# Altium project LF-timegate-REVB.PrjPcb (part 1 of 2)
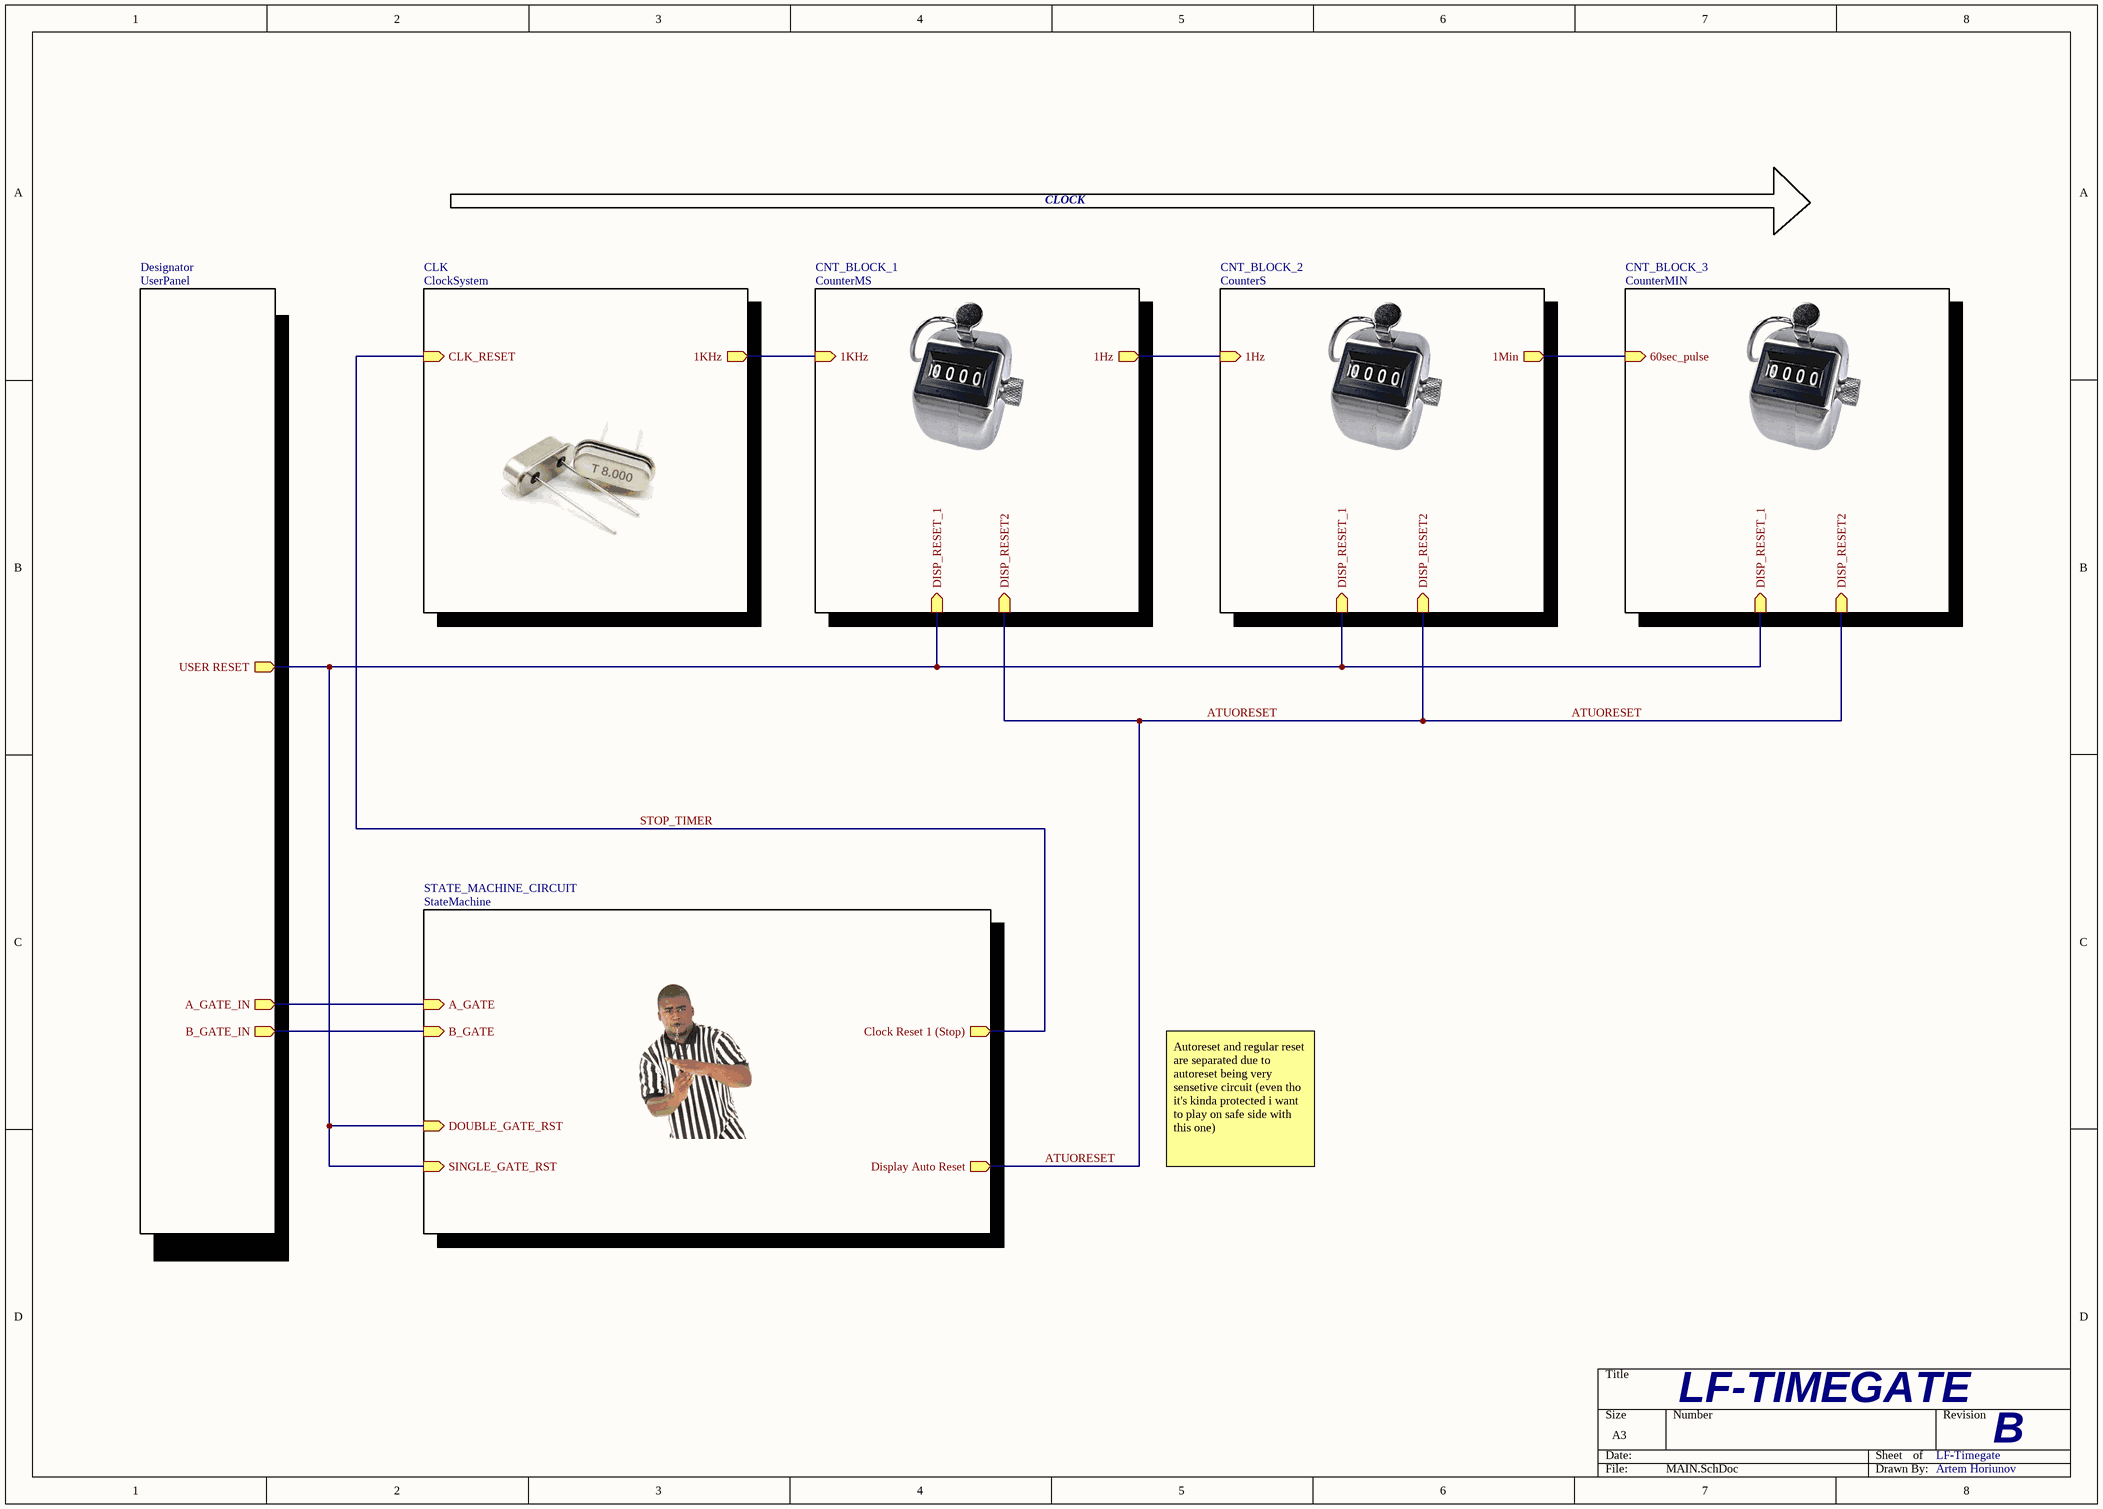
[diagram p0: MAIN.SchDoc]
12 sheets, 214 parts. Net scope: hierarchical (ports join the sheet entries above them; power ports are global).
Sheets:
  MAIN.SchDoc
    CLK = ClockSystem.SchDoc
    CNT_BLOCK_1 = CounterMS.SchDoc
      CNT1 = Counter_Normal.SchDoc
      CNT2 = Counter_Normal.SchDoc
      CNT3 = Counter_INV.SchDoc
        DISP? = LSD150BAG-101-01.SchDoc
    CNT_BLOCK_2 = CounterS.SchDoc
      CNT4 = Counter_Normal.SchDoc
      CNT5 = Counter_INV.SchDoc
        DISP? = LSD150BAG-101-01.SchDoc
    CNT_BLOCK_3 = CounterMIN.SchDoc
      CNT1 = Counter_Normal.SchDoc
    STATE_MACHINE_CIRCUIT = StateMachine.SchDoc
      SR LATCH CIRCUIT = SR.SchDoc
      EDGE DETECTOR = Autoreset.SchDoc
    Designator = UserPanel.SchDoc

## Sheet MAIN.SchDoc
size A3; SheetNumber: 1; SheetTotal: 12

### Sub-sheets
CLK = ClockSystem: CLK_RESET (in), 1KHz (out)
CNT_BLOCK_1 = CounterMS: DISP_RESET2 (in), DISP_RESET_1 (in), 1Hz (out), 1KHz (in)
CNT_BLOCK_2 = CounterS: DISP_RESET2 (in), DISP_RESET_1 (in), 1Hz (in), 1Min (out)
CNT_BLOCK_3 = CounterMIN: DISP_RESET2 (in), DISP_RESET_1 (in), 60sec_pulse (in)
Designator = UserPanel: A_GATE_IN (out), B_GATE_IN (out), USER RESET (out)
STATE_MACHINE_CIRCUIT = StateMachine: B_GATE (in), DOUBLE_GATE_RST (in), A_GATE (in), SINGLE_GATE_RST (in), Clock Reset 1 (Stop) (out), Display Auto Reset (out)

### Nets
1Hz: sheet CNT_BLOCK_1/1Hz, sheet CNT_BLOCK_2/1Hz
1KHz: sheet CLK/1KHz, sheet CNT_BLOCK_1/1KHz
1Min: sheet CNT_BLOCK_2/1Min, sheet CNT_BLOCK_3/60sec_pulse
ATUORESET: sheet CNT_BLOCK_1/DISP_RESET2, sheet CNT_BLOCK_2/DISP_RESET2, sheet CNT_BLOCK_3/DISP_RESET2, sheet STATE_MACHINE_CIRCUIT/Display Auto Reset
CNT_RESET1: sheet CNT_BLOCK_1/DISP_RESET_1, sheet CNT_BLOCK_2/DISP_RESET_1, sheet CNT_BLOCK_3/DISP_RESET_1, sheet STATE_MACHINE_CIRCUIT/DOUBLE_GATE_RST, sheet STATE_MACHINE_CIRCUIT/SINGLE_GATE_RST, sheet Designator/USER RESET
STOP_TIMER: sheet CLK/CLK_RESET, sheet STATE_MACHINE_CIRCUIT/Clock Reset 1 (Stop)
NetA_GATE_1: sheet STATE_MACHINE_CIRCUIT/A_GATE, sheet Designator/A_GATE_IN
NetB_GATE_1: sheet STATE_MACHINE_CIRCUIT/B_GATE, sheet Designator/B_GATE_IN

### Notes on the sheet
- CLOCK
- Autoreset and regular reset are separated due to autoreset being very sensetive circuit (even tho it's kinda protected i want to play on safe side with this one)
- LF-TIMEGATE
- LF-Timegate
- B
- Artem Horiunov

## Sheet ClockSystem.SchDoc
size A4; SheetNumber: 2; SheetTotal: 12
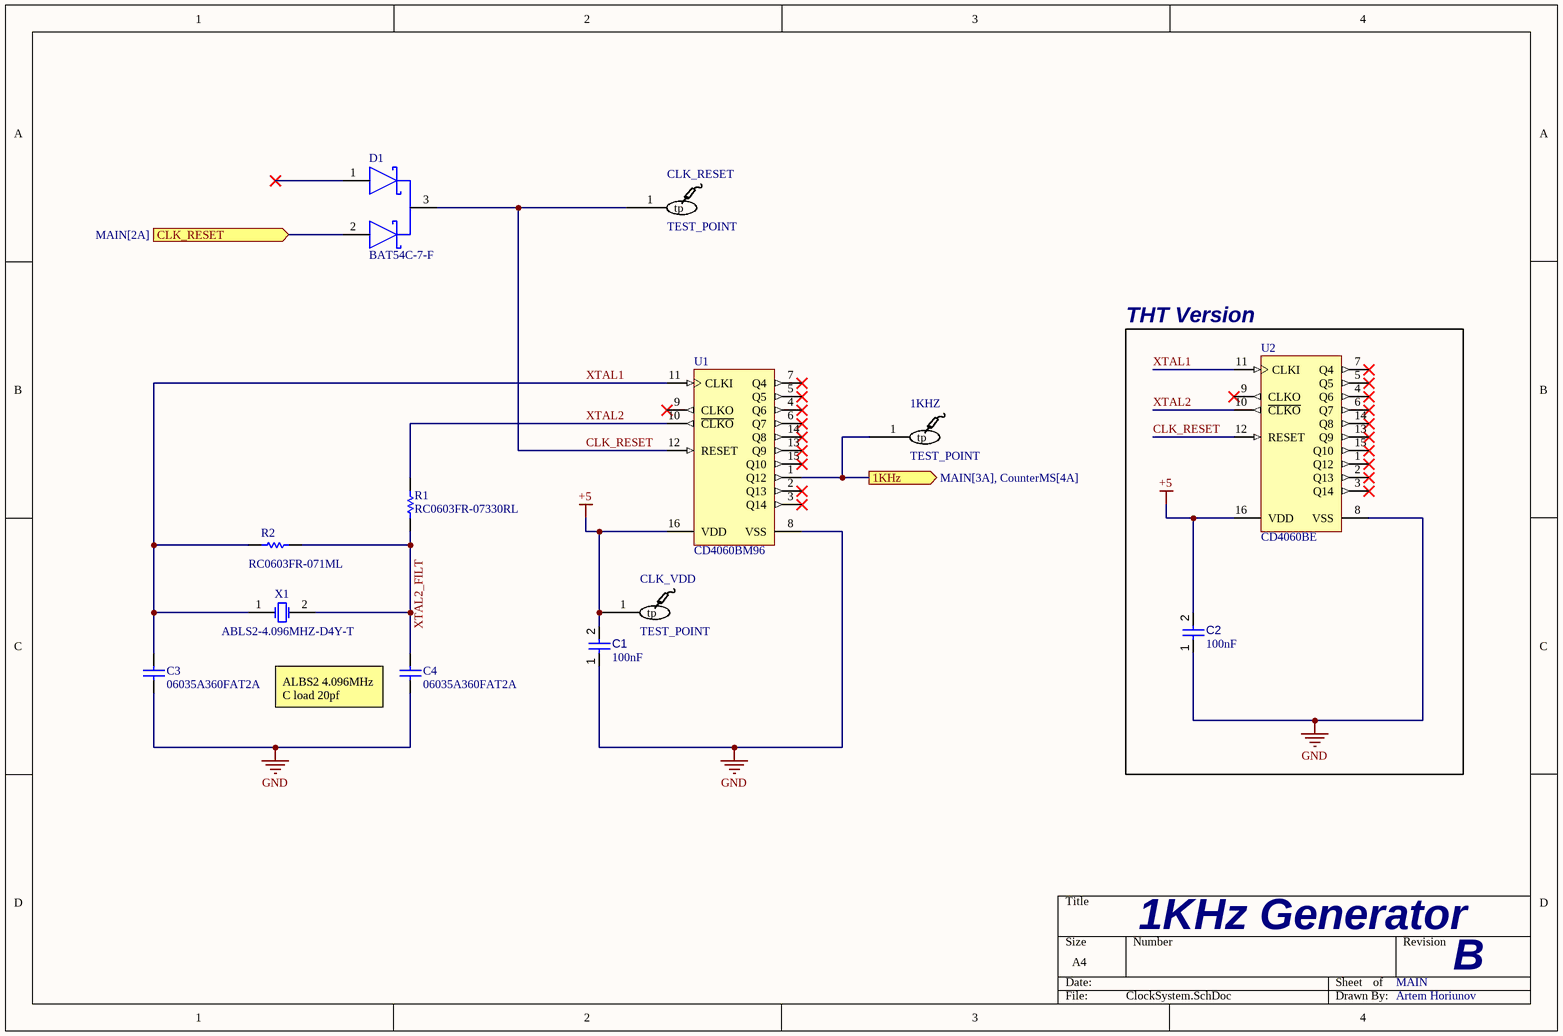
[diagram p1: ClockSystem.SchDoc]

### Parts
1KHZ  TEST_POINT  [TestPoint-Footprint-1]
C1  value 100nF  [CAPC2013X95X50LL10T25]  (hidden comment: Capacitor 100 nF +/-10% 50 V 0805)
C2  value 100nF  [CAPC2013X95X50LL10T25]  (hidden comment: Capacitor 100 nF +/-10% 50 V 0805)
C3  06035A360FAT2A  [CAPC1608X90X35LL15T15]
C4  06035A360FAT2A  [CAPC1608X90X35LL15T15]
CLK_RESET  TEST_POINT  [TestPoint-Footprint-1]
CLK_VDD  TEST_POINT  [TestPoint-Footprint-1]
D1  BAT54C-7-F  [FP-SOT23-IPC_B]
R1  RC0603FR-07330RL  [RESC1608X55X25NL10T15]
R2  RC0603FR-071ML  [RESC1608X55X25LL10T15]
U1  CD4060BM96  [D0016A_L]
U2  CD4060BE  [N0016A]
X1  ABLS2-4.096MHZ-D4Y-T  [ABRA-ABLS2-2_V]

### Blocks framed on the sheet
THT Version: C2 U2

### Ports
1KHz (out, see MAIN[3A], CounterMS[4A]), CLK_RESET (in, see MAIN[2A])

### Nets
+5: C1.2 C2.2 CLK_VDD.1(tp) U1.16(VDD) U2.16(VDD)
GND: C1.1 C2.1 C3.1 C4.1 U1.8(VSS) U2.8(VSS)  [project net R-SEG]
1KHz: 1KHZ.1(tp) U1.1(Q12) ; port 1KHz
CLK_RESET: CLK_RESET.1(tp) D1.3(COMMON_CATHODE) U1.12(RESET) U2.12(RESET)
STOP_TIMER: D1.2(2_ANODE) ; port CLK_RESET
XTAL1: C3.2 R2.1 U1.11(CLKI) U2.11(CLKI) X1.1(X1)
XTAL2: R1.2 U1.10(~{CLKO}) U2.10(~{CLKO})
XTAL2_FILT: C4.2 R1.1 R2.2 X1.2(X2)

Not connected (* = marked no-connect by the designer): D1 1(1_ANODE)*; U1 2(Q13)* 3(Q14)* 4(Q6)* 5(Q5)* 6(Q7)* 7(Q4)* 9(CLKO)* 13(Q9)* 14(Q8)* 15(Q10)*; U2 1(Q12)* 2(Q13)* 3(Q14)* 4(Q6)* 5(Q5)* 6(Q7)* 7(Q4)* 9(CLKO)* 13(Q9)* 14(Q8)* 15(Q10)*

### Notes on the sheet
- (near C4) ALBS2 4.096MHz C load 20pf
- 1KHz Generator
- MAIN
- B
- Artem Horiunov

### Library data of the parts
1KHZ CLK_RESET CLK_VDD = CMP-00001-5: Pad for testing
C1 C2 = CMP-001-00018-6: Chip Capacitor, 100 nF, +/- 10%, 50 V, 0805 (2012 Metric); Capacitor Type: Ceramic; Voltage Rating: 50V; Pins: 2; Max Operating Temperature: 125°C; Min Operating Temperature: -55°C; Mounting Technology: SM; Case/Package: 0805; RoHS Compliant: True; Tolerance: 10%
C3 C4 = CMP-2006-04595-1: Manufacturer: AVX Interconnect / Elco; Part Number: 06035A360FAT2A
D1 = CMP-12790-000084-1: DIODE ARRAY SCHOTTKY 30V SOT23-3; Max Reverse Current: 2uA; Power Dissipation: 200mW; Average Rectified Current: 200mA; Capacitance: 10pF; Peak Non-Repetitive Surge Current: 600mA; Forward Voltage: 800mV; Reverse Recovery Time: 5ns; Element Configuration: Common Cathode; Max Operating Temperature: 150°C; Max Reverse Voltage (DC): 30V; Power Rating: 200mW; Termination: SMD/SMT; REACH SVHC: No SVHC; Voltage Rating (DC): 30V; Series: -; Current Rating: 200mA; RoHS Compliant: Yes; Max Power Dissipation: 200mW; Case/Package: SOT-23; Max Repetitive Reverse Voltage (Vrrm): 30V; Width: 1.3mm; Min Operating Temperature: -65°C; Lead Free: Lead Free; Forward Current: 200mA; Number of Pins: 3; Contact Plating: Tin; Package Quantity: 3000; Length: 2.9mm; Radiation Hardening: No; Max Forward Surge Current (Ifsm): 600mA; Height: 1mm; Packaging: Tape and Reel; Mount: Surface Mount; Weight: 0.000282oz
R1 = CMP-1659-00020-2: Chip Resistor, 330 Ohm, +/- 1%, 0.1 W, -55 to 155 degC, 0603 (1608 Metric), RoHS, Tape and Reel; Tolerance: 10%; ESR: 800 mohm; Voltage Rating (DC): 16 V; Capacitance: 47 uF; Length: 7.3 mm; ComponentLink1URL: http://www.yageo.com/; Packaging: Tape and Reel; Pins: 2; ComponentLink1Description: Manufacturer URL; Case Code (Imperial): 2917; REACH SVHC: No SVHC; Width: 4.3 mm; ComponentLink2Description: Datasheet; Voltage Rating: 16 V; RoHSCompliant: True; Max Operating Temperature: 125degC; ComponentLink2URL: http://www.yageo.com/documents/recent/PYu-RC_Group_51_RoHS_L_04.pdf; Min Operating Temperature: -55degC; Case/Package: 2917; Radiation Hardening: No; DatasheetVersion: Rev. 4, 02/2016; Mount: Surface Mount; PackageReference: 0603; Package Quantity: 500; Case Code (Metric): 7343; PackageDescription: 2-Pin Surface Mount Device, Body 1.6 x 0.8 mm; Height: 3.1 mm
R2 = CMP-1659-00056-1: Chip Resistor, 1 MOhm, +/- 1%, 100 mW, -55 to 155 degC, 0603 (1608 Metric), RoHS, Tape and Reel; Voltage Rating (DC): 25 V; Tolerance: 20%; Case\Package: Radial; Capacitance: 1 mF; Min Operating Temperature: -40 degC; PackageDescription: 2-Pin Surface Mount Device, Body 1.6 x 0.8 mm; ComponentLink1Description: Manufacturer URL; Radiation Hardening: No; DatasheetVersion: Rev. 4, 02/2016; REACH SVHC: No SVHC; Length: 20 mm; Max Operating Temperature: 85 degC; Diameter: 10 mm; Packaging: Bulk; Package Quantity: 200; PackageReference: 0603; Mount: Through Hole; ComponentLink1URL: http://www.yageo.com/; ComponentLink2URL: http://www.yageo.com/documents/recent/PYu-RC_Group_51_RoHS_L_04.pdf; ComponentLink2Description: Datasheet; Width: 0 inch; Lead Pitch: 5 mm; RoHSCompliant: true; Voltage Rating: 25 V; Height: 20 mm
U1 = CMP-1086-00004-4: CMOS 14-Stage Ripple Carry Binary Counter / Divider and Oscillator, 3 to 18 V, -55 to 125 degC, 16-Pin SOIC (D), Green (RoHS & no Sb/Br), Tape and Reel; Manufacturer: Texas Instruments; tPHL, tPLH (typ) @ 5 V: 370 ns; VDD: 3 to 18 V; Mounting Technology: Surface Mount; PackageReference: D0016A; ComponentLink3URL: http://www.ti.com/lit/ml/mpds178g/mpds178g.pdf; ComponentLink3Description: Package Specification; ComponentLink2URL: http://www.ti.com/lit/ds/symlink/cd4060b.pdf; PackageVersion: 4040047-6/M; PackageDescription: 16-Pin Plastic Small-Outline Package, Body 9.9 x 3.9 mm, Pitch 1.27 mm; DatasheetVersion: SCHS049C; PartNumber: CD4060BM96; ComponentLink2Description: Datasheet; Note1: Green (RoHS & no Sb/Br); ComponentLink1Description: Manufacturer URL; Temperature Range: -55 to 125 degC; Packing: Tape and Reel; ComponentLink1URL: http://www.ti.com
U2 = CMP-1086-00011-4: CMOS 14-Stage Ripple Carry Binary Counter / Divider and Oscillator, 3 to 18 V, -55 to 125 degC, 16-Pin PDIP (N), RoHS, Tube; Manufacturer: Texas Instruments; tPHL, tPLH (typ) @ 5 V: 370 ns; VDD: 3 to 18 V; PackageDescription: 16-Pin Plastic Dual In-Line Package, Body 19.305 x 6.35 mm, Pitch 2.54 mm; ComponentLink1URL: http://www.ti.com; ComponentLink3Description: Package Specification; DatasheetVersion: SCHS049C; PackageVersion: 4040049/E; Packing: Tube; ComponentLink2Description: Datasheet; Mounting Technology: Through Hole; ComponentLink2URL: http://www.ti.com/lit/ds/symlink/cd4060b.pdf; ComponentLink3URL: http://www.ti.com/lit/ml/mpdi002c/mpdi002c.pdf; Temperature Range: -55 to 125 degC; PackageReference: N0016A; ComponentLink1Description: Manufacturer URL; RoHS: TRUE; PartNumber: CD4060BE
X1 = CMP-0277-00002-1: Low Profile Surface Mount Microprocessor Crystal, 4.096 MHz +/-30 ppm, 180 Ohm, -40 to 85 degC, 2-Pin 11.4 x 4.7 x 3.3 mm SMD, RoHS, Tape and Reel; Manufacturer: Abracon; Operation Mode: Fundamental or 3rd Overtone; Shunt Capacitance: 7 pF Max.; ESR: 180 Ohm; Load Capacitance: 18 pF; Mounting Technology: Surface Mount; PackageDescription: 2-Pin SMD, Body 11.4 x 4.7 mm, Height 3.3 mm; ComponentLink1URL: http://www.abracon.com/; Freq. Stability: +/- 30 ppm; ComponentLink2Description: Datasheet; PartNumber: ABLS2-4.096MHZ-D4Y-T; Operating Temp. Range: -40 to 85 degC; Packing: Tape and Reel; RoHS: TRUE; PackageReference: ABLS2-2; DatasheetVersion: Rev. 03.31.11; Freq. Tolerance: +/- 30 ppm; Frequency: 4.096 MHz; ComponentLink2URL: http://www.abracon.com/Resonators/ABLS2.pdf; ComponentLink1Description: Manufacturer URL

## Sheet CounterMS.SchDoc
size A4; SheetNumber: 3; SheetTotal: 12
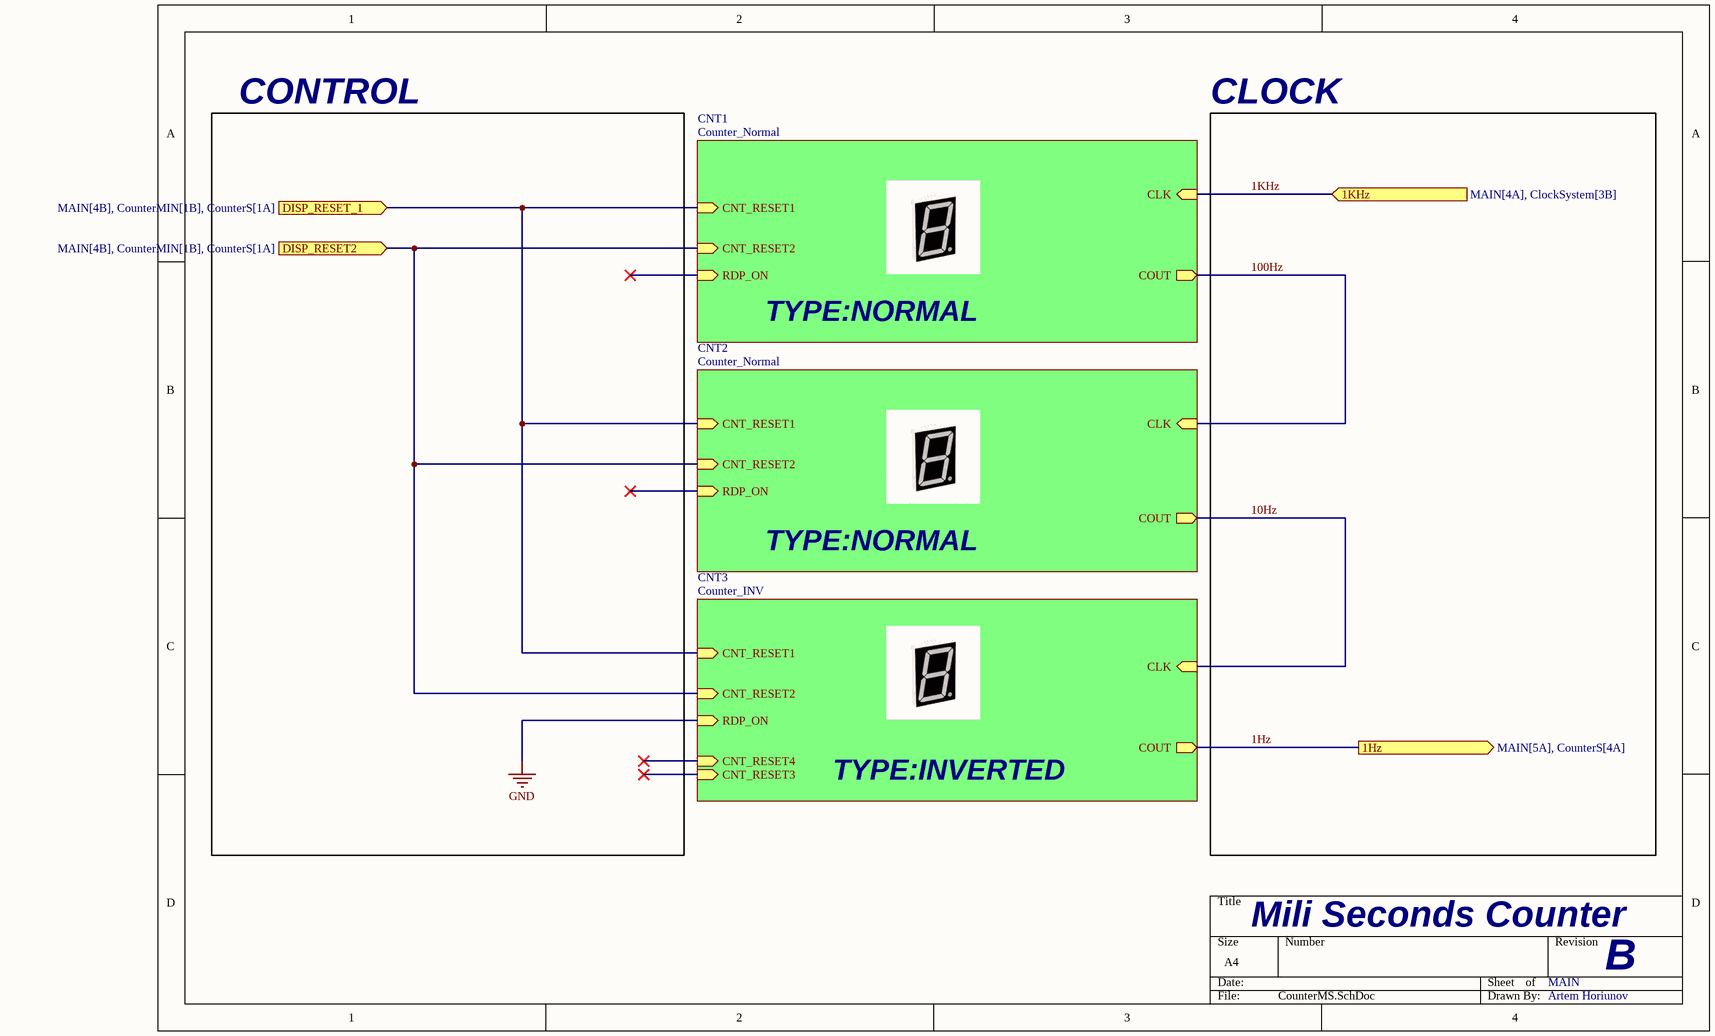
[diagram p2: CounterMS.SchDoc]

### Sub-sheets
CNT1 = Counter_Normal: COUT (out), CNT_RESET1 (in), CNT_RESET2 (in), CLK (in), RDP_ON (in)
CNT2 = Counter_Normal: COUT (out), CNT_RESET1 (in), CNT_RESET2 (in), CLK (in), RDP_ON (in)
CNT3 = Counter_INV: COUT (out), CNT_RESET1 (in), CNT_RESET2 (in), CLK (in), RDP_ON (in), CNT_RESET4 (in), CNT_RESET3 (in)

### Ports
1Hz (out, see MAIN[5A], CounterS[4A]), 1KHz (in, see MAIN[4A], ClockSystem[3B]), DISP_RESET2 (in, see MAIN[4B], CounterMIN[1B], CounterS[1A]), DISP_RESET_1 (in, see MAIN[4B], CounterMIN[1B], CounterS[1A])

### Nets
1Hz: port 1Hz, sheet CNT3/COUT
1KHz: port 1KHz, sheet CNT1/CLK
10Hz: sheet CNT2/COUT, sheet CNT3/CLK
100Hz: sheet CNT1/COUT, sheet CNT2/CLK
ATUORESET: port DISP_RESET2, sheet CNT1/CNT_RESET2, sheet CNT2/CNT_RESET2, sheet CNT3/CNT_RESET2
CNT_RESET1: port DISP_RESET_1, sheet CNT1/CNT_RESET1, sheet CNT2/CNT_RESET1, sheet CNT3/CNT_RESET1

### Notes on the sheet
- CONTROL
- CLOCK
- TYPE:NORMAL
- TYPE:INVERTED
- Mili Seconds Counter
- MAIN
- B
- Artem Horiunov

## Sheet Counter_Normal.SchDoc
size A4; SheetNumber: 4; SheetTotal: 10
Used 4 times, as channels CNT_BLOCK_1/CNT1, CNT_BLOCK_1/CNT2, CNT_BLOCK_2/CNT4, CNT_BLOCK_3/CNT1. Parts and nets are listed once, with the designators drawn on the sheet.
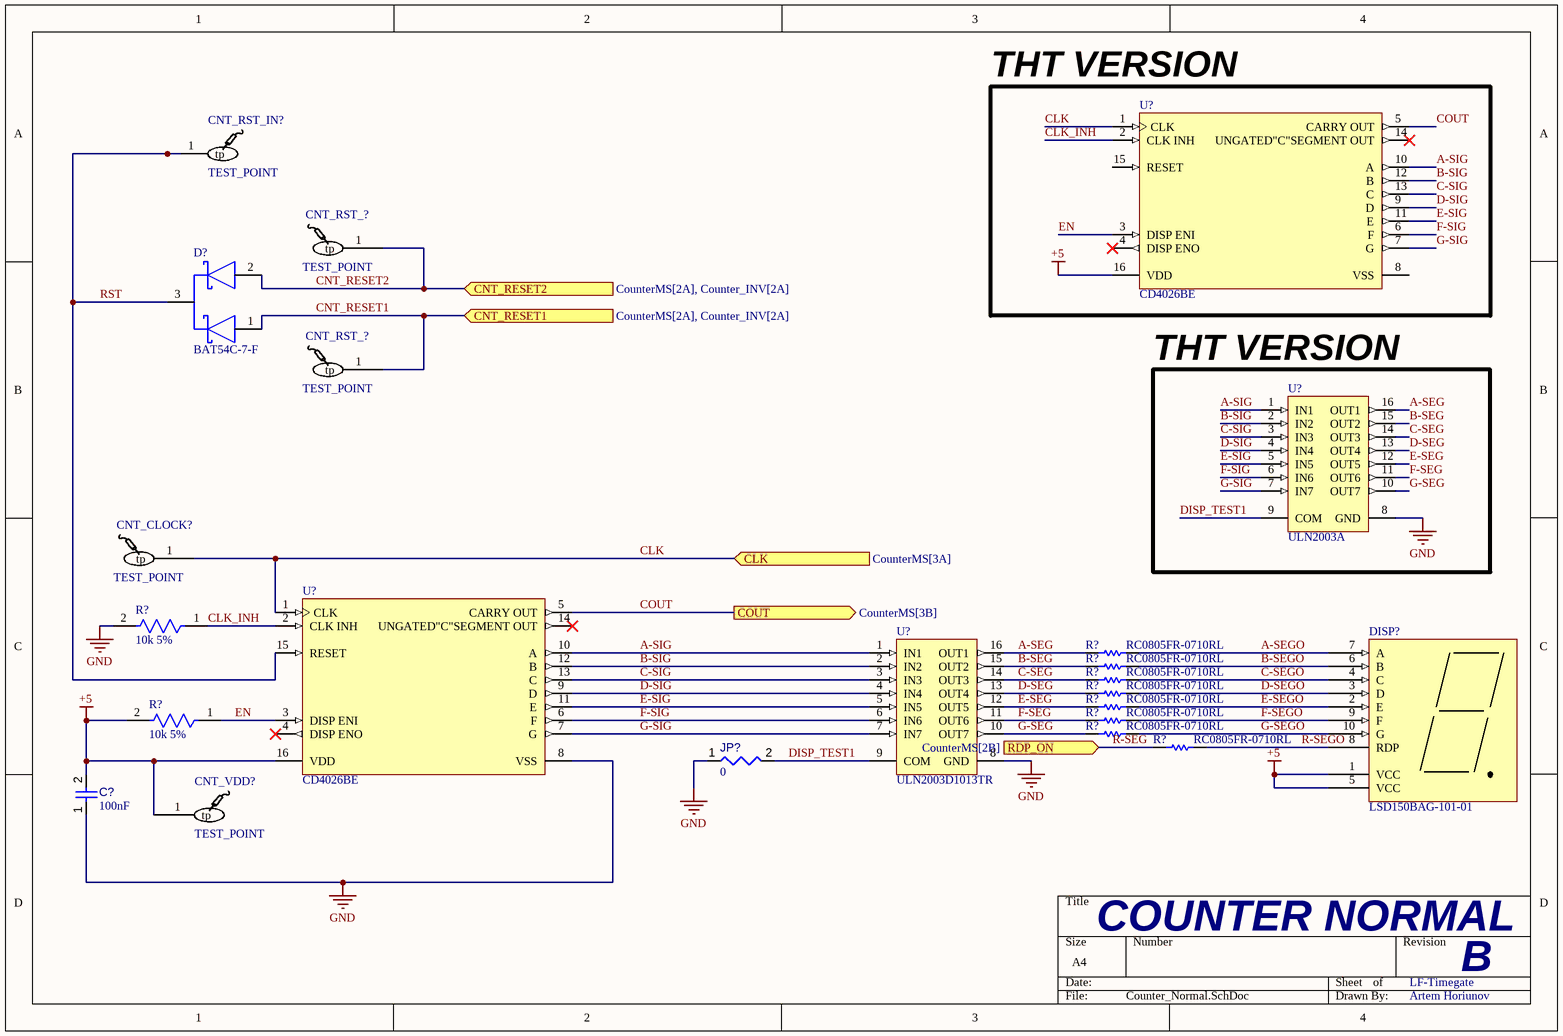
[diagram p3: Counter_Normal.SchDoc]

### Parts
(Parts that share a designator on the sheet are numbered #1, #2 ... from top to bottom, then left to right.)
C?  value 100nF  [CAPC2013X95X50LL10T25]  (hidden comment: Capacitor 100 nF +/-10% 50 V 0805)
CNT_CLOCK?  TEST_POINT  [TestPoint-Footprint-1]
CNT_RST_?#1  TEST_POINT  [TestPoint-Footprint-1]
CNT_RST_?#2  TEST_POINT  [TestPoint-Footprint-1]
CNT_RST_IN?  TEST_POINT  [TestPoint-Footprint-1]
CNT_VDD?  TEST_POINT  [TestPoint-Footprint-1]
D?  BAT54C-7-F  [FP-SOT23-IPC_B]
DISP?  LSD150BAG-101-01  [7 segment display]
JP?  value 0  [RESC0603(1608)_L]  (hidden comment: Jumper 0603)
R?#1  10k 5%  [FP-RC0603-0_55-IPC_C]
R?#2  RC0805FR-0710RL  [RESC2013X60X35ML10T20]
R?#3  RC0805FR-0710RL  [RESC2013X60X35ML10T20]
R?#4  RC0805FR-0710RL  [RESC2013X60X35ML10T20]
R?#5  RC0805FR-0710RL  [RESC2013X60X35ML10T20]
R?#6  RC0805FR-0710RL  [RESC2013X60X35ML10T20]
R?#7  10k 5%  [FP-RC0603-0_55-IPC_C]
R?#8  RC0805FR-0710RL  [RESC2013X60X35ML10T20]
R?#9  RC0805FR-0710RL  [RESC2013X60X35ML10T20]
R?#10  RC0805FR-0710RL  [RESC2013X60X35ML10T20]
U?#1  CD4026BE  [N0016A]
U?#2  ULN2003A  [STM-DIP-16L]
U?#3  CD4026BE  [N0016A]
U?#4  ULN2003D1013TR  [STM-SO-16_M]

### Blocks framed on the sheet
THT VERSION: U?#2

### Ports
CLK (in, see CounterMS[3A]), CNT_RESET1 (in, see CounterMS[2A], Counter_INV[2A]), CNT_RESET2 (in, see CounterMS[2A], Counter_INV[2A]), COUT (out, see CounterMS[3B]), RDP_ON (in, see CounterMS[2B])

### Nets
+5: C?.2 CNT_VDD?.1(tp) DISP?.1(VCC) DISP?.5(VCC) R?#7.2 U?#1.16(VDD) U?#3.16(VDD)
GND: C?.1 JP?.1 R?#1.2 U?#2.8(GND) U?#3.8(VSS) U?#4.8(GND)
A-SEG: R?#2.1 U?#2.16(OUT1) U?#4.16(OUT1)
A-SEGO: DISP?.7(A) R?#2.2
A-SIG: U?#1.10(A) U?#2.1(IN1) U?#3.10(A) U?#4.1(IN1)
B-SEG: R?#3.1 U?#2.15(OUT2) U?#4.15(OUT2)
B-SEGO: DISP?.6(B) R?#3.2
B-SIG: U?#1.12(B) U?#2.2(IN2) U?#3.12(B) U?#4.2(IN2)
C-SEG: R?#4.1 U?#2.14(OUT3) U?#4.14(OUT3)
C-SEGO: DISP?.4(C) R?#4.2
C-SIG: U?#1.13(C) U?#2.3(IN3) U?#3.13(C) U?#4.3(IN3)
CLK: CNT_CLOCK?.1(tp) U?#1.1(CLK) U?#3.1(CLK) ; port CLK
CLK_INH: R?#1.1 U?#1.2(CLK_INH) U?#3.2(CLK_INH)
CNT_RESET1: CNT_RST_?#2.1(tp) D?.1(1_ANODE) ; port CNT_RESET1
CNT_RESET2: CNT_RST_?#1.1(tp) D?.2(2_ANODE) ; port CNT_RESET2
COUT: U?#1.5(CARRY_OUT) U?#3.5(CARRY_OUT) ; port COUT
D-SEG: R?#5.1 U?#2.13(OUT4) U?#4.13(OUT4)
D-SEGO: DISP?.3(D) R?#5.2
D-SIG: U?#1.9(D) U?#2.4(IN4) U?#3.9(D) U?#4.4(IN4)
DISP_TEST1: JP?.2 U?#2.9(COM) U?#4.9(COM)
E-SEG: R?#6.1 U?#2.12(OUT5) U?#4.12(OUT5)
E-SEGO: DISP?.2(E) R?#6.2
E-SIG: U?#1.11(E) U?#2.5(IN5) U?#3.11(E) U?#4.5(IN5)
EN: R?#7.1 U?#1.3(DISP_ENI) U?#3.3(DISP_ENI)
F-SEG: R?#8.1 U?#2.11(OUT6) U?#4.11(OUT6)
F-SEGO: DISP?.9(F) R?#8.2
F-SIG: U?#1.6(F) U?#2.6(IN6) U?#3.6(F) U?#4.6(IN6)
G-SEG: R?#9.1 U?#2.10(OUT7) U?#4.10(OUT7)
G-SEGO: DISP?.10(G) R?#9.2
G-SIG: U?#1.7(G) U?#2.7(IN7) U?#3.7(G) U?#4.7(IN7)
R-SEG: R?#10.1 ; port RDP_ON
R-SEGO: DISP?.8(RDP) R?#10.2
RST: CNT_RST_IN?.1(tp) D?.3(COMMON_CATHODE) U?#3.15(RESET)

Not connected (* = marked no-connect by the designer): U?#1 4(DISP_ENO)* 8(VSS) 14(UNGATED"C"SEGMENT_OUT)* 15(RESET); U?#3 4(DISP_ENO)* 14(UNGATED"C"SEGMENT_OUT)*

### Channels
CNT_BLOCK_1/CNT1: designators C?=C?_CNT_BLOCK_1_CNT1 CNT_CLOCK?=CNT_CLOCK?_CNT_BLOCK_1_CNT1 CNT_RST_?=CNT_RST_?_CNT_BLOCK_1_CNT1#1 CNT_RST_?=CNT_RST_?_CNT_BLOCK_1_CNT1#2 CNT_RST_IN?=CNT_RST_IN?_CNT_BLOCK_1_CNT1 CNT_VDD?=CNT_VDD?_CNT_BLOCK_1_CNT1 D?=D?_CNT_BLOCK_1_CNT1 DISP?=DISP?_CNT_BLOCK_1_CNT1 JP?=JP?_CNT_BLOCK_1_CNT1 R?=R?_CNT_BLOCK_1_CNT1#7 R?=R?_CNT_BLOCK_1_CNT1#2 R?=R?_CNT_BLOCK_1_CNT1#3 R?=R?_CNT_BLOCK_1_CNT1#4 R?=R?_CNT_BLOCK_1_CNT1#5 R?=R?_CNT_BLOCK_1_CNT1#6 R?=R?_CNT_BLOCK_1_CNT1#8 R?=R?_CNT_BLOCK_1_CNT1#9 R?=R?_CNT_BLOCK_1_CNT1#1 R?=R?_CNT_BLOCK_1_CNT1#10 U?=U?_CNT_BLOCK_1_CNT1#2 U?=U?_CNT_BLOCK_1_CNT1#4 U?=U?_CNT_BLOCK_1_CNT1#3 U?=U?_CNT_BLOCK_1_CNT1#1; ports CLK=1KHz CNT_RESET1=CNT_RESET1 CNT_RESET2=ATUORESET COUT=100Hz RDP_ON=R-SEG_CNT1
CNT_BLOCK_1/CNT2: designators C?=C?_CNT2 CNT_CLOCK?=CNT_CLOCK?_CNT2 CNT_RST_?=CNT_RST_?_CNT2#1 CNT_RST_?=CNT_RST_?_CNT2#2 CNT_RST_IN?=CNT_RST_IN?_CNT2 CNT_VDD?=CNT_VDD?_CNT2 D?=D?_CNT2 DISP?=DISP?_CNT2 JP?=JP?_CNT2 R?=R?_CNT2#7 R?=R?_CNT2#2 R?=R?_CNT2#3 R?=R?_CNT2#4 R?=R?_CNT2#5 R?=R?_CNT2#6 R?=R?_CNT2#8 R?=R?_CNT2#9 R?=R?_CNT2#1 R?=R?_CNT2#10 U?=U?_CNT2#2 U?=U?_CNT2#4 U?=U?_CNT2#3 U?=U?_CNT2#1; ports CLK=100Hz CNT_RESET1=CNT_RESET1 CNT_RESET2=ATUORESET COUT=10Hz RDP_ON=R-SEG_CNT2
CNT_BLOCK_2/CNT4: designators C?=C?_CNT4 CNT_CLOCK?=CNT_CLOCK?_CNT4 CNT_RST_?=CNT_RST_?_CNT4#1 CNT_RST_?=CNT_RST_?_CNT4#2 CNT_RST_IN?=CNT_RST_IN?_CNT4 CNT_VDD?=CNT_VDD?_CNT4 D?=D?_CNT4 DISP?=DISP?_CNT4 JP?=JP?_CNT4 R?=R?_CNT4#7 R?=R?_CNT4#2 R?=R?_CNT4#3 R?=R?_CNT4#4 R?=R?_CNT4#5 R?=R?_CNT4#6 R?=R?_CNT4#8 R?=R?_CNT4#9 R?=R?_CNT4#1 R?=R?_CNT4#10 U?=U?_CNT4#2 U?=U?_CNT4#4 U?=U?_CNT4#3 U?=U?_CNT4#1; ports CLK=1Hz CNT_RESET1=CNT_RESET1 CNT_RESET2=ATUORESET COUT=0.1Hz RDP_ON=R-SEG
CNT_BLOCK_3/CNT1: designators C?=C?_CNT_BLOCK_3_CNT1 CNT_CLOCK?=CNT_CLOCK?_CNT_BLOCK_3_CNT1 CNT_RST_?=CNT_RST_?_CNT_BLOCK_3_CNT1#1 CNT_RST_?=CNT_RST_?_CNT_BLOCK_3_CNT1#2 CNT_RST_IN?=CNT_RST_IN?_CNT_BLOCK_3_CNT1 CNT_VDD?=CNT_VDD?_CNT_BLOCK_3_CNT1 D?=D?_CNT_BLOCK_3_CNT1 DISP?=DISP?_CNT_BLOCK_3_CNT1 JP?=JP?_CNT_BLOCK_3_CNT1 R?=R?_CNT_BLOCK_3_CNT1#7 R?=R?_CNT_BLOCK_3_CNT1#2 R?=R?_CNT_BLOCK_3_CNT1#3 R?=R?_CNT_BLOCK_3_CNT1#4 R?=R?_CNT_BLOCK_3_CNT1#5 R?=R?_CNT_BLOCK_3_CNT1#6 R?=R?_CNT_BLOCK_3_CNT1#8 R?=R?_CNT_BLOCK_3_CNT1#9 R?=R?_CNT_BLOCK_3_CNT1#1 R?=R?_CNT_BLOCK_3_CNT1#10 U?=U?_CNT_BLOCK_3_CNT1#2 U?=U?_CNT_BLOCK_3_CNT1#4 U?=U?_CNT_BLOCK_3_CNT1#3 U?=U?_CNT_BLOCK_3_CNT1#1; ports CLK=1Min CNT_RESET1=CNT_RESET1 CNT_RESET2=ATUORESET COUT=COUT_CNT1 RDP_ON=R-SEG

### Notes on the sheet
- (near U?#1) THT VERSION
- COUNTER NORMAL
- LF-Timegate
- B
- Artem Horiunov

### Library data of the parts
C? = CMP-001-00018-6: as C1 on sheet ClockSystem; Pins: 2; Max Operating Temperature: 125°C; Min Operating Temperature: -55°C; Mounting Technology: SM; Case/Package: 0805; RoHS Compliant: True; Tolerance: 10%
CNT_CLOCK? CNT_RST_?#1 CNT_RST_?#2 CNT_RST_IN? CNT_VDD? = CMP-00001-5: Pad for testing
D? = CMP-12790-000084-1: as D1 on sheet ClockSystem; Max Operating Temperature: 150°C; Max Reverse Voltage (DC): 30V; Power Rating: 200mW; Termination: SMD/SMT; REACH SVHC: No SVHC; Voltage Rating (DC): 30V; Series: -; Current Rating: 200mA; RoHS Compliant: Yes; Max Power Dissipation: 200mW; Case/Package: SOT-23; Max Repetitive Reverse Voltage (Vrrm): 30V; Width: 1.3mm; Min Operating Temperature: -65°C; Lead Free: Lead Free; Forward Current: 200mA; Number of Pins: 3; Contact Plating: Tin; Package Quantity: 3000; Length: 2.9mm; Radiation Hardening: No; Max Forward Surge Current (Ifsm): 600mA; Height: 1mm; Packaging: Tape and Reel; Mount: Surface Mount; Weight: 0.000282oz
DISP? = CMP-007-00036-2: 7 segment display 1.5 inch
JP? = CMP-009-00175-3: Pins: 2; Min Operating Temperature: -55°C; Max Operating Temperature: 155°C; Case/Package: 0603
R?#1 R?#7 = CMP-2100-03664-2: RES 10K OHM 1% 1/10W 0603; Voltage Rating: 75V; Voltage Rating (DC): 50V; Resistance: 10kR; Power Rating: 100mW; Temperature Coefficient: 100ppm/°C; Depth: 0.8mm; Termination: SMD/SMT; Resistor Type: Thick Film; Series: RC; Construction: Rectangular; Features: Moisture Resistant; Packaging: Tape and Reel; Min Operating Temperature: -55°C; Number of Terminations: 2; Lead Pitch: 0.3mm; RoHS Compliant: Yes; Case/Package: 0603; Resistance Tolerance: 1%; Military Standard: Not; Weight: 7.1E-05oz; Number of Pins: 2; Tolerance: 1%; Length: 1.6mm; Case Code (Imperial): 0603; Lead Free: Lead Free; Width: 0.8mm; Max Power Dissipation: 100mW; Height: 0.45mm; Max Operating Temperature: 155°C; Case Code (Metric): 1608; Size Code: 0603
R?#2-R?#6 R?#8-R?#10 = CMP-2100-03670-1: Chip Resistor, 10 Ohm, +/- 1%, 0.125 W, -55 to 155 degC, 0805 (2012 Metric), RoHS, Tape and Reel; Manufacturer: Yageo; Resistance: 10Ohm; Power Rating: 125mW; Voltage Rating: 150V; Temperature Coefficient: 200ppm/degreesC; Number of Pins: 2; REACH SVHC: NoSVHC; Datasheet Version: Rev. 5, 10/2016; Max Operating Temperature: 155degC; Manufacturer URL: http://www.yageo.com/; Case Code (Imperial): 0805; Package Description: 2-Pin Surface Mounted Device, Body 2 x 1.25 mm; Case Code (Metric): 2012; Length: 2mm; RoHSCompliant: true; Max Power Dissipation: 125mW; Depth: 1.25mm; Packaging: TapeandReel; Height: 0.5mm; Package Reference: 0805; Package Quantity: 1; Tolerance: 1%; Termination: SMD/SMT; Min Operating Temperature: -55degC; Lead Free: LeadFree; Width: 1.25mm; Voltage Rating (DC): 150V; Datasheet URL: http://www.yageo.com/NewPortal/yageodocoutput?fileName=/pdf/R-Chip/PYu-RC_Group_51_RoHS_L_5.pdf; Composition: ThickFilm; Number of Terminations: 2; Case/Package: 0805
U?#1 U?#3 = CMP-1623-00561-2: CMOS Decade Counter/Divider with Decoded 7-Segment Display Outputs and Display Enable, N0016A, TUBE; Manufacturer: Texas Instruments; ICC @ Nom Voltage(Max)(mA): 0.03; tpd @ Nom Voltage(Max)(ns): 250; F @ Nom Voltage(Max)(Mhz): 8; Bits(#): 7; VCC(Max)(V): 18; VCC(Min)(V): 3; Output Drive (IOL/IOH)(Max)(mA): 1.5/-1.5; Inputs: 1; Rating: Catalog; Technology Family: CD4000; Schmitt Trigger: No; Voltage(Nom)(V): 5,10,15; DatasheetVersion: SCHS031B; Operating Temperature Range(C): -55 to 125; Code_JEDEC: MS-001; Input Type: CMOS; Output Type: CMOS; Type: Decade; Generic Part Number: CD4026B; PackageReference: N0016A; Function: Counter
U?#2 = CMP-2000-07351-1: Seven Darlington Array, 50 V, 0.5 A, -40 to 85 degC, 16-Pin DIP, RoHS, Tube; Manufacturer: STMicroelectronics; Transistor Polarity: NPN; VOUT: 50V; No. of Pins: 16Pins; SVHC: NoSVHC(17-Dec-2015); DC Current Gain hFE: 1000hFE; Output Current: 0.5A; DC Collector Current: 500mA; Transistor Case Style: DIP; Package Reference: DIP-16L; Automotive Qualification Standard: -; Mounting Technology: ThroughHole; Power Dissipation Pd: -; Collector Emitter Voltage V(br)ceo: 50V; Datasheet URL: http://www2.st.com/content/ccc/resource/technical/document/datasheet/f3/6e/c8/64/4d/b3/4e/38/CD00001244.pdf/files/CD00001244.pdf/jcr:content/translations/en.CD00001244.pdf; Manufacturer URL: http://www.st.com/; PartNumber: ULN2003A; MSL: MSL2-1year; Product Range: -; Package Description: 16-Pin DIP, Body 19.7 x 7.1 mm, Pitch 2.54 mm; Operating Temperature Max: 85°C; Datasheet Version: Rev. 8, 06/2012
U?#4 = CMP-2000-05374-1: Seven NPN Darlington Array Transistor, 50 V, 500 mA, -40 to 85 degC, 8-Pin SOIC, RoHS, Tape and Reel; Manufacturer: STMicroelectronics; Collector Emitter Voltage V(br)ceo: 50V; SVHC: NoSVHC(17-Dec-2015); DC Current Gain hFE: 1000hFE; DC Collector Current: 500mA; No. of Pins: 16Pins; Package Reference: SO-16; Transistor Polarity: NPN; Transistor Case Style: SOIC; Datasheet URL: https://datasheet.ciiva.com/1193/1690348-1193460.pdf; Package Description: 16-Pin Small Outline Integrated Circuit, Body 9.9 x 3.9 mm, Pitch 1.27 mm; Datasheet Version: Rev. 8, 06/2012; Power Dissipation Pd: -; Product Range: -; Operating Temperature Max: 85degC; MSL: MSL1-Unlimited; Manufacturer URL: http://www.st.com/; Automotive Qualification Standard: -

## Sheet Counter_INV.SchDoc
size A4; SheetNumber: 5; SheetTotal: 12
Used 2 times, as channels CNT_BLOCK_1/CNT3, CNT_BLOCK_2/CNT5. Parts and nets are listed once, with the designators drawn on the sheet.
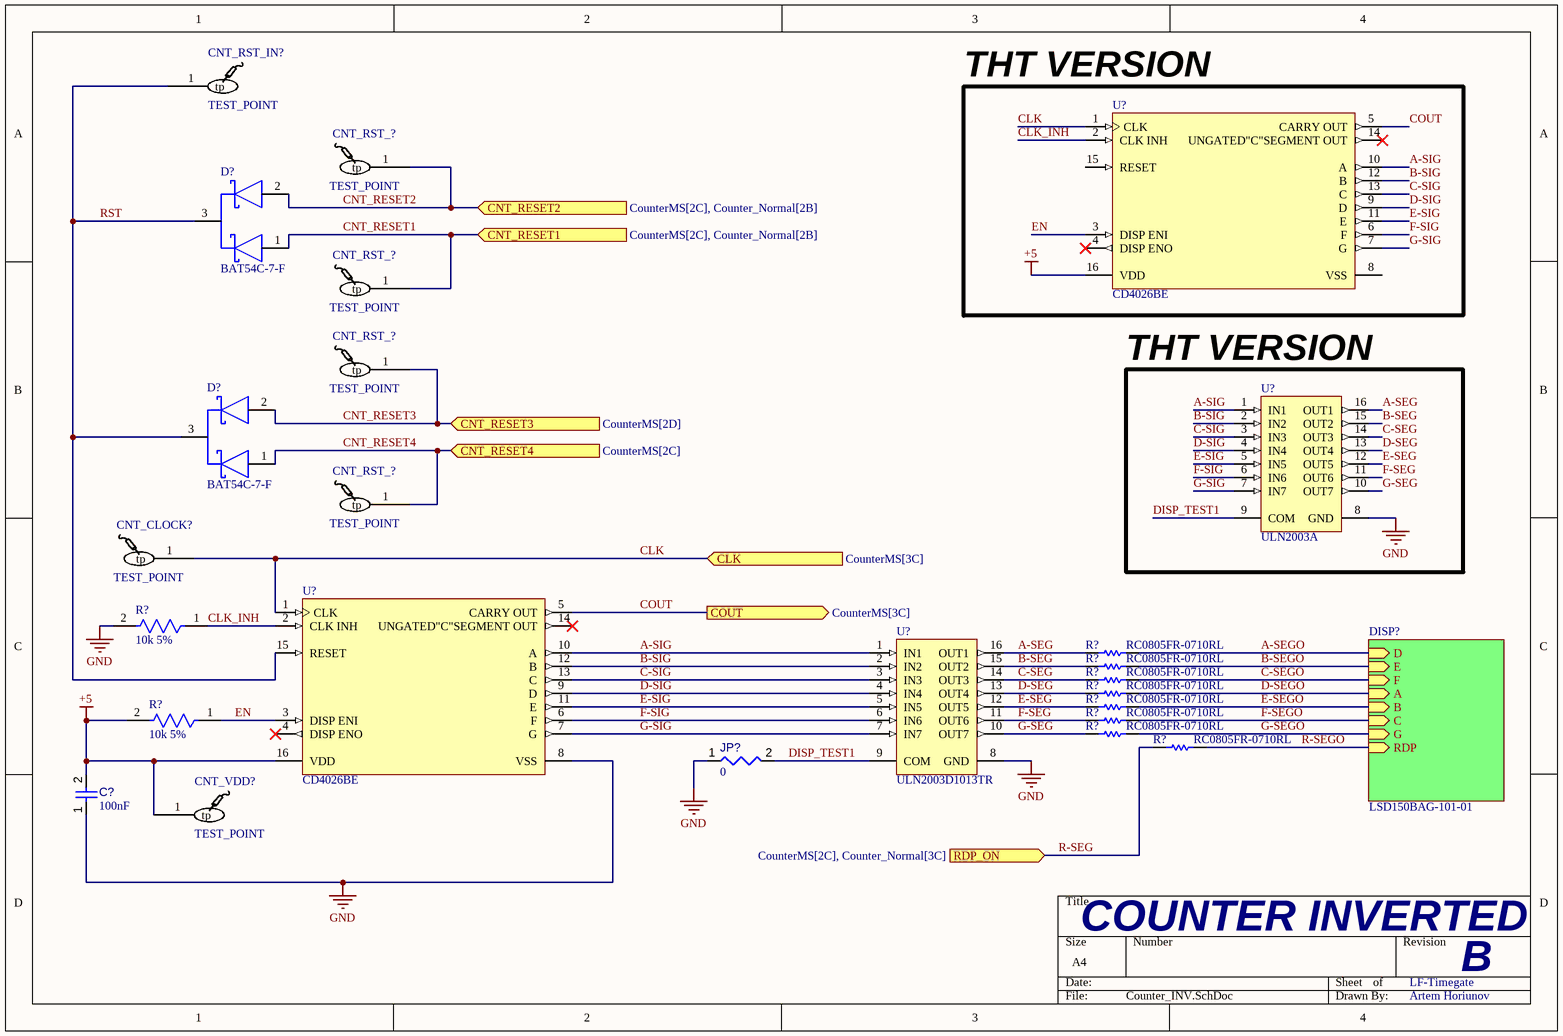
[diagram p4: Counter_INV.SchDoc]

### Parts
(Parts that share a designator on the sheet are numbered #1, #2 ... from top to bottom, then left to right.)
C?  value 100nF  [CAPC2013X95X50LL10T25]  (hidden comment: Capacitor 100 nF +/-10% 50 V 0805)
CNT_CLOCK?  TEST_POINT  [TestPoint-Footprint-1]
CNT_RST_?#1  TEST_POINT  [TestPoint-Footprint-1]
CNT_RST_?#2  TEST_POINT  [TestPoint-Footprint-1]
CNT_RST_?#3  TEST_POINT  [TestPoint-Footprint-1]
CNT_RST_?#4  TEST_POINT  [TestPoint-Footprint-1]
CNT_RST_IN?  TEST_POINT  [TestPoint-Footprint-1]
CNT_VDD?  TEST_POINT  [TestPoint-Footprint-1]
D?#1  BAT54C-7-F  [FP-SOT23-IPC_B]
D?#2  BAT54C-7-F  [FP-SOT23-IPC_B]
JP?  value 0  [RESC0603(1608)_L]  (hidden comment: Jumper 0603)
R?#1  10k 5%  [FP-RC0603-0_55-IPC_C]
R?#2  RC0805FR-0710RL  [RESC2013X60X35ML10T20]
R?#3  RC0805FR-0710RL  [RESC2013X60X35ML10T20]
R?#4  RC0805FR-0710RL  [RESC2013X60X35ML10T20]
R?#5  RC0805FR-0710RL  [RESC2013X60X35ML10T20]
R?#6  RC0805FR-0710RL  [RESC2013X60X35ML10T20]
R?#7  10k 5%  [FP-RC0603-0_55-IPC_C]
R?#8  RC0805FR-0710RL  [RESC2013X60X35ML10T20]
R?#9  RC0805FR-0710RL  [RESC2013X60X35ML10T20]
R?#10  RC0805FR-0710RL  [RESC2013X60X35ML10T20]
U?#1  CD4026BE  [N0016A]
U?#2  ULN2003A  [STM-DIP-16L]
U?#3  CD4026BE  [N0016A]
U?#4  ULN2003D1013TR  [STM-SO-16_M]

### Blocks framed on the sheet
THT VERSION: U?#1
THT VERSION: U?#2

### Sub-sheets
DISP? = LSD150BAG-101-01: E (in), D (in), C (in), B (in), A (in), RDP (in), F (in), G (in)

### Ports
CLK (in, see CounterMS[3C]), CNT_RESET1 (in, see CounterMS[2C], Counter_Normal[2B]), CNT_RESET2 (in, see CounterMS[2C], Counter_Normal[2B]), CNT_RESET3 (in, see CounterMS[2D]), CNT_RESET4 (in, see CounterMS[2C]), COUT (out, see CounterMS[3C]), RDP_ON (in, see CounterMS[2C], Counter_Normal[3C])

### Nets
+5: C?.2 CNT_VDD?.1(tp) R?#7.2 U?#1.16(VDD) U?#3.16(VDD)
GND: C?.1 JP?.1 R?#1.2 U?#2.8(GND) U?#3.8(VSS) U?#4.8(GND)
A-SEG: R?#2.1 U?#2.16(OUT1) U?#4.16(OUT1)
A-SEGO: R?#2.2 ; sheet DISP?/D
A-SIG: U?#1.10(A) U?#2.1(IN1) U?#3.10(A) U?#4.1(IN1)
B-SEG: R?#3.1 U?#2.15(OUT2) U?#4.15(OUT2)
B-SEGO: R?#3.2 ; sheet DISP?/E
B-SIG: U?#1.12(B) U?#2.2(IN2) U?#3.12(B) U?#4.2(IN2)
C-SEG: R?#4.1 U?#2.14(OUT3) U?#4.14(OUT3)
C-SEGO: R?#4.2 ; sheet DISP?/F
C-SIG: U?#1.13(C) U?#2.3(IN3) U?#3.13(C) U?#4.3(IN3)
CLK: CNT_CLOCK?.1(tp) U?#1.1(CLK) U?#3.1(CLK) ; port CLK
CLK_INH: R?#1.1 U?#1.2(CLK_INH) U?#3.2(CLK_INH)
CNT_RESET1: CNT_RST_?#2.1(tp) D?#1.1(1_ANODE) ; port CNT_RESET1
CNT_RESET2: CNT_RST_?#1.1(tp) D?#1.2(2_ANODE) ; port CNT_RESET2
CNT_RESET3: CNT_RST_?#3.1(tp) D?#2.2(2_ANODE) ; port CNT_RESET3
CNT_RESET4: CNT_RST_?#4.1(tp) D?#2.1(1_ANODE) ; port CNT_RESET4
COUT: U?#1.5(CARRY_OUT) U?#3.5(CARRY_OUT) ; port COUT
D-SEG: R?#5.1 U?#2.13(OUT4) U?#4.13(OUT4)
D-SEGO: R?#5.2 ; sheet DISP?/A
D-SIG: U?#1.9(D) U?#2.4(IN4) U?#3.9(D) U?#4.4(IN4)
DISP_TEST1: JP?.2 U?#2.9(COM) U?#4.9(COM)
E-SEG: R?#6.1 U?#2.12(OUT5) U?#4.12(OUT5)
E-SEGO: R?#6.2 ; sheet DISP?/B
E-SIG: U?#1.11(E) U?#2.5(IN5) U?#3.11(E) U?#4.5(IN5)
EN: R?#7.1 U?#1.3(DISP_ENI) U?#3.3(DISP_ENI)
F-SEG: R?#8.1 U?#2.11(OUT6) U?#4.11(OUT6)
F-SEGO: R?#8.2 ; sheet DISP?/C
F-SIG: U?#1.6(F) U?#2.6(IN6) U?#3.6(F) U?#4.6(IN6)
G-SEG: R?#9.1 U?#2.10(OUT7) U?#4.10(OUT7)
G-SEGO: R?#9.2 ; sheet DISP?/G
G-SIG: U?#1.7(G) U?#2.7(IN7) U?#3.7(G) U?#4.7(IN7)
R-SEG: R?#10.1 ; port RDP_ON
R-SEGO: R?#10.2 ; sheet DISP?/RDP
RST: CNT_RST_IN?.1(tp) D?#1.3(COMMON_CATHODE) D?#2.3(COMMON_CATHODE) U?#3.15(RESET)

Not connected (* = marked no-connect by the designer): U?#1 4(DISP_ENO)* 8(VSS) 14(UNGATED"C"SEGMENT_OUT)* 15(RESET); U?#3 4(DISP_ENO)* 14(UNGATED"C"SEGMENT_OUT)*

### Channels
CNT_BLOCK_1/CNT3: designators C?=C?_CNT3 CNT_CLOCK?=CNT_CLOCK?_CNT3 CNT_RST_?=CNT_RST_?_CNT3#1 CNT_RST_?=CNT_RST_?_CNT3#2 CNT_RST_?=CNT_RST_?_CNT3#4 CNT_RST_?=CNT_RST_?_CNT3#3 CNT_RST_IN?=CNT_RST_IN?_CNT3 CNT_VDD?=CNT_VDD?_CNT3 D?=D?_CNT3#1 D?=D?_CNT3#2 JP?=JP?_CNT3 R?=R?_CNT3#7 R?=R?_CNT3#2 R?=R?_CNT3#3 R?=R?_CNT3#4 R?=R?_CNT3#5 R?=R?_CNT3#6 R?=R?_CNT3#8 R?=R?_CNT3#9 R?=R?_CNT3#1 R?=R?_CNT3#10 U?=U?_CNT3#2 U?=U?_CNT3#4 U?=U?_CNT3#3 U?=U?_CNT3#1; ports CLK=10Hz CNT_RESET1=CNT_RESET1 CNT_RESET2=ATUORESET CNT_RESET3=CNT_RESET3_CNT3 CNT_RESET4=CNT_RESET4_CNT3 COUT=1Hz RDP_ON=R-SEG
CNT_BLOCK_2/CNT5: designators C?=C?_CNT5 CNT_CLOCK?=CNT_CLOCK?_CNT5 CNT_RST_?=CNT_RST_?_CNT5#1 CNT_RST_?=CNT_RST_?_CNT5#2 CNT_RST_?=CNT_RST_?_CNT5#4 CNT_RST_?=CNT_RST_?_CNT5#3 CNT_RST_IN?=CNT_RST_IN?_CNT5 CNT_VDD?=CNT_VDD?_CNT5 D?=D?_CNT5#1 D?=D?_CNT5#2 JP?=JP?_CNT5 R?=R?_CNT5#7 R?=R?_CNT5#2 R?=R?_CNT5#3 R?=R?_CNT5#4 R?=R?_CNT5#5 R?=R?_CNT5#6 R?=R?_CNT5#8 R?=R?_CNT5#9 R?=R?_CNT5#1 R?=R?_CNT5#10 U?=U?_CNT5#2 U?=U?_CNT5#4 U?=U?_CNT5#3 U?=U?_CNT5#1; ports CLK=0.1Hz CNT_RESET1=CNT_RESET1 CNT_RESET2=CNT_RESET1 CNT_RESET3=60Sec_pulse CNT_RESET4=CNT_RESET4_CNT5 COUT=1Min RDP_ON=R-SEG

### Notes on the sheet
- COUNTER INVERTED
- LF-Timegate
- B
- Artem Horiunov

### Library data of the parts
C? = CMP-001-00018-6: as C1 on sheet ClockSystem; Pins: 2; Max Operating Temperature: 125°C; Min Operating Temperature: -55°C; Mounting Technology: SM; Case/Package: 0805; RoHS Compliant: True; Tolerance: 10%
CNT_CLOCK? CNT_RST_?#1-CNT_RST_?#4 CNT_RST_IN? CNT_VDD? = CMP-00001-5: Pad for testing
D?#1 D?#2 = CMP-12790-000084-1: as D1 on sheet ClockSystem; Max Operating Temperature: 150°C; Max Reverse Voltage (DC): 30V; Power Rating: 200mW; Termination: SMD/SMT; REACH SVHC: No SVHC; Voltage Rating (DC): 30V; Series: -; Current Rating: 200mA; RoHS Compliant: Yes; Max Power Dissipation: 200mW; Case/Package: SOT-23; Max Repetitive Reverse Voltage (Vrrm): 30V; Width: 1.3mm; Min Operating Temperature: -65°C; Lead Free: Lead Free; Forward Current: 200mA; Number of Pins: 3; Contact Plating: Tin; Package Quantity: 3000; Length: 2.9mm; Radiation Hardening: No; Max Forward Surge Current (Ifsm): 600mA; Height: 1mm; Packaging: Tape and Reel; Mount: Surface Mount; Weight: 0.000282oz
JP? = CMP-009-00175-3: Pins: 2; Min Operating Temperature: -55°C; Max Operating Temperature: 155°C; Case/Package: 0603
R?#1 R?#7 = CMP-2100-03664-2: as R?#1 on sheet Counter_Normal; Depth: 0.8mm; Termination: SMD/SMT; Resistor Type: Thick Film; Series: RC; Construction: Rectangular; Features: Moisture Resistant; Packaging: Tape and Reel; Min Operating Temperature: -55°C; Number of Terminations: 2; Lead Pitch: 0.3mm; RoHS Compliant: Yes; Case/Package: 0603; Resistance Tolerance: 1%; Military Standard: Not; Weight: 7.1E-05oz; Number of Pins: 2; Tolerance: 1%; Length: 1.6mm; Case Code (Imperial): 0603; Lead Free: Lead Free; Width: 0.8mm; Max Power Dissipation: 100mW; Height: 0.45mm; Max Operating Temperature: 155°C; Case Code (Metric): 1608; Size Code: 0603
R?#2-R?#6 R?#8-R?#10 = CMP-2100-03670-1: as R?#2 on sheet Counter_Normal; Number of Pins: 2; REACH SVHC: NoSVHC; Datasheet Version: Rev. 5, 10/2016; Max Operating Temperature: 155degC; Manufacturer URL: http://www.yageo.com/; Case Code (Imperial): 0805; Package Description: 2-Pin Surface Mounted Device, Body 2 x 1.25 mm; Case Code (Metric): 2012; Length: 2mm; RoHSCompliant: true; Max Power Dissipation: 125mW; Depth: 1.25mm; Packaging: TapeandReel; Height: 0.5mm; Package Reference: 0805; Package Quantity: 1; Tolerance: 1%; Termination: SMD/SMT; Min Operating Temperature: -55degC; Lead Free: LeadFree; Width: 1.25mm; Voltage Rating (DC): 150V; Datasheet URL: http://www.yageo.com/NewPortal/yageodocoutput?fileName=/pdf/R-Chip/PYu-RC_Group_51_RoHS_L_5.pdf; Composition: ThickFilm; Number of Terminations: 2; Case/Package: 0805
U?#1 U?#3 = CMP-1623-00561-2: as U?#1 on sheet Counter_Normal; DatasheetVersion: SCHS031B; Operating Temperature Range(C): -55 to 125; Code_JEDEC: MS-001; Input Type: CMOS; Output Type: CMOS; Type: Decade; Generic Part Number: CD4026B; PackageReference: N0016A; Function: Counter
U?#2 = CMP-2000-07351-1: as U?#2 on sheet Counter_Normal; Transistor Case Style: DIP; Package Reference: DIP-16L; Automotive Qualification Standard: -; Mounting Technology: ThroughHole; Power Dissipation Pd: -; Collector Emitter Voltage V(br)ceo: 50V; Datasheet URL: http://www2.st.com/content/ccc/resource/technical/document/datasheet/f3/6e/c8/64/4d/b3/4e/38/CD00001244.pdf/files/CD00001244.pdf/jcr:content/translations/en.CD00001244.pdf; Manufacturer URL: http://www.st.com/; PartNumber: ULN2003A; MSL: MSL2-1year; Product Range: -; Package Description: 16-Pin DIP, Body 19.7 x 7.1 mm, Pitch 2.54 mm; Operating Temperature Max: 85°C; Datasheet Version: Rev. 8, 06/2012
U?#4 = CMP-2000-05374-1: as U?#4 on sheet Counter_Normal; Package Reference: SO-16; Transistor Polarity: NPN; Transistor Case Style: SOIC; Datasheet URL: https://datasheet.ciiva.com/1193/1690348-1193460.pdf; Package Description: 16-Pin Small Outline Integrated Circuit, Body 9.9 x 3.9 mm, Pitch 1.27 mm; Datasheet Version: Rev. 8, 06/2012; Power Dissipation Pd: -; Product Range: -; Operating Temperature Max: 85degC; MSL: MSL1-Unlimited; Manufacturer URL: http://www.st.com/; Automotive Qualification Standard: -

## Sheet LSD150BAG-101-01.SchDoc
size A4; SheetNumber: 6; SheetTotal: 12
Used 2 times, as channels CNT_BLOCK_1/CNT3/DISP?, CNT_BLOCK_2/CNT5/DISP?. Parts and nets are listed once, with the designators drawn on the sheet.
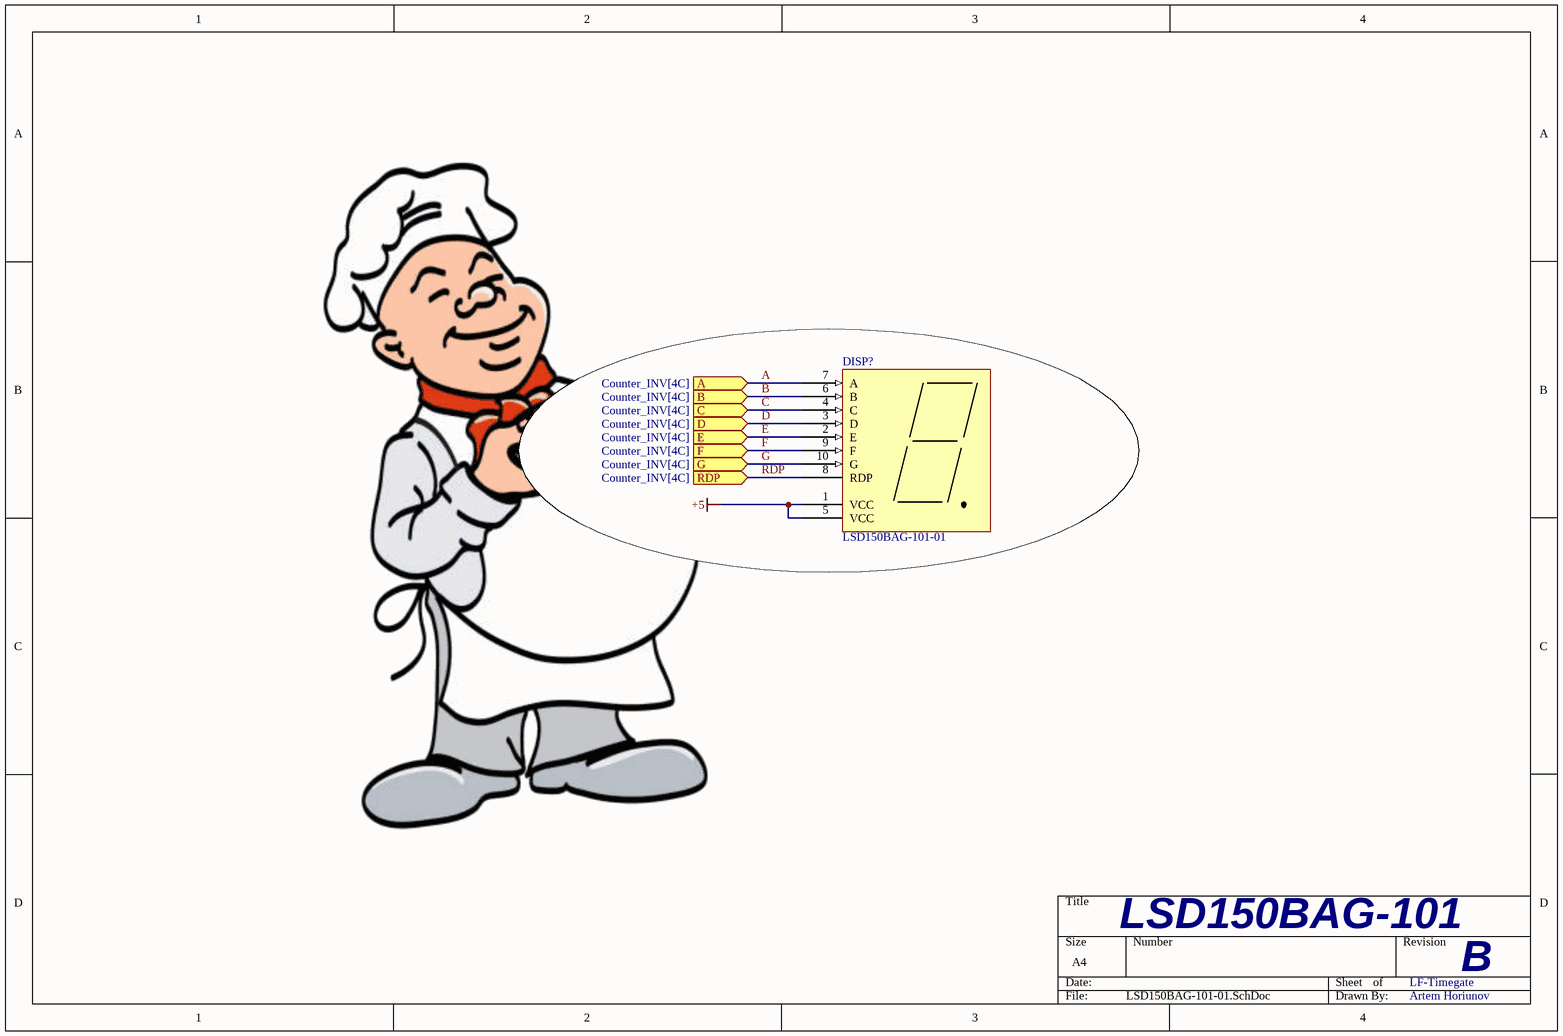
[diagram p5: LSD150BAG-101-01.SchDoc]

### Parts
DISP?  LSD150BAG-101-01  [7 segment display]

### Ports
A (in, see Counter_INV[4C]), B (in, see Counter_INV[4C]), C (in, see Counter_INV[4C]), D (in, see Counter_INV[4C]), E (in, see Counter_INV[4C]), F (in, see Counter_INV[4C]), G (in, see Counter_INV[4C]), RDP (in, see Counter_INV[4C])

### Nets
+5: DISP?.1(VCC) DISP?.5(VCC)
A: DISP?.7(A) ; port A
B: DISP?.6(B) ; port B
C: DISP?.4(C) ; port C
D: DISP?.3(D) ; port D
E: DISP?.2(E) ; port E
F: DISP?.9(F) ; port F
G: DISP?.10(G) ; port G
RDP: DISP?.8(RDP) ; port RDP

### Channels
CNT_BLOCK_1/CNT3/DISP?: designators end in _CNT_BLOCK_1_CNT3_DISP?; ports A=A B=B C=C D=A-SEGO_CNT3 E=B-SEGO_CNT3 F=C-SEGO_CNT3 G=G RDP=R-SEGO_CNT3
CNT_BLOCK_2/CNT5/DISP?: designators end in _CNT_BLOCK_2_CNT5_DISP?; ports A=A B=B C=C D=A-SEGO_CNT5 E=B-SEGO_CNT5 F=C-SEGO_CNT5 G=G RDP=R-SEGO_CNT5

### Notes on the sheet
- LSD150BAG-101
- LF-Timegate
- B
- Artem Horiunov

### Library data of the parts
DISP? = CMP-007-00036-2: 7 segment display 1.5 inch

## Sheet CounterS.SchDoc
size A4; SheetNumber: 7; SheetTotal: 12
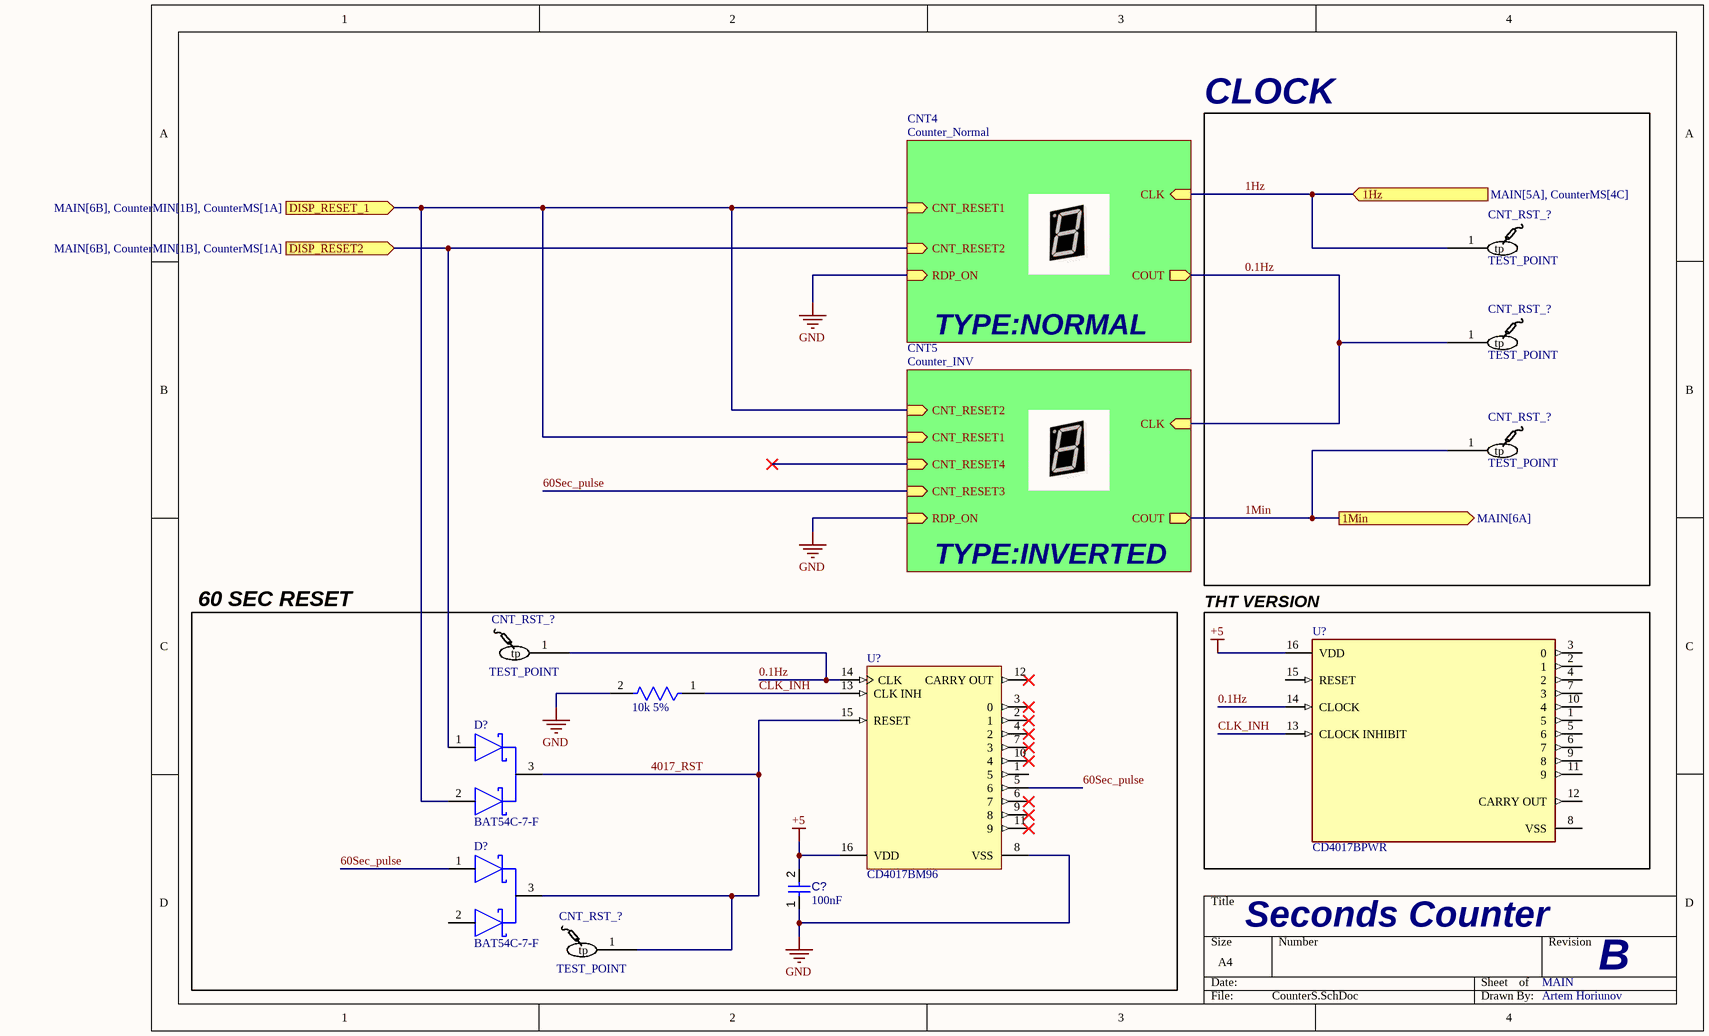
[diagram p6: CounterS.SchDoc]

### Parts
(Parts that share a designator on the sheet are numbered #1, #2 ... from top to bottom, then left to right.)
?  10k 5%  [FP-RC0603-0_55-IPC_C]
C?#1  value 100nF  [CAPC2013X95X50LL10T25]  (hidden comment: Capacitor 100 nF +/-10% 50 V 0805)
CNT_RST_?#1  TEST_POINT  [TestPoint-Footprint-1]
CNT_RST_?#2  TEST_POINT  [TestPoint-Footprint-1]
CNT_RST_?#3  TEST_POINT  [TestPoint-Footprint-1]
CNT_RST_?#4  TEST_POINT  [TestPoint-Footprint-1]
CNT_RST_?#5  TEST_POINT  [TestPoint-Footprint-1]
D?#1  BAT54C-7-F  [FP-SOT23-IPC_B]
D?#2  BAT54C-7-F  [FP-SOT23-IPC_B]
U?#1  CD4017BPWR  [FP-PW0016A-IPC_B]
U?#2  CD4017BM96  [D0016A_L]

### Blocks framed on the sheet
CLOCK: CNT_RST_?#1-CNT_RST_?#3

### Sub-sheets
CNT4 = Counter_Normal: COUT (out), CNT_RESET1 (in), CNT_RESET2 (in), CLK (in), RDP_ON (in)
CNT5 = Counter_INV: COUT (out), CNT_RESET1 (in), CNT_RESET2 (in), CLK (in), RDP_ON (in), CNT_RESET4 (in), CNT_RESET3 (in)

### Ports
1Hz (in, see MAIN[5A], CounterMS[4C]), 1Min (out, see MAIN[6A]), DISP_RESET2 (in, see MAIN[6B], CounterMIN[1B], CounterMS[1A]), DISP_RESET_1 (in, see MAIN[6B], CounterMIN[1B], CounterMS[1A])

### Nets
+5: C?#1.2 U?#1.16(VDD) U?#2.16(VDD)
GND: ?.2 C?#1.1 U?#2.8(VSS) ; sheet CNT4/RDP_ON, sheet CNT5/RDP_ON  [project net R-SEG]
0.1Hz: CNT_RST_?#2.1(tp) CNT_RST_?#4.1(tp) U?#1.14(CLOCK) U?#2.14(CLK) ; sheet CNT4/COUT, sheet CNT5/CLK
1Hz: CNT_RST_?#1.1(tp) ; port 1Hz, sheet CNT4/CLK
1Min: CNT_RST_?#3.1(tp) ; port 1Min, sheet CNT5/COUT
60Sec_pulse: D?#2.1(1_ANODE) U?#2.5(6) ; sheet CNT5/CNT_RESET3
4017_RST: CNT_RST_?#5.1(tp) D?#1.3(COMMON_CATHODE) D?#2.3(COMMON_CATHODE) U?#2.15(RESET)
ATUORESET: D?#1.1(1_ANODE) ; port DISP_RESET2, sheet CNT4/CNT_RESET2
CLK_INH: ?.1 U?#1.13(CLOCK_INHIBIT) U?#2.13(CLK_INH)
CNT_RESET1: D?#1.2(2_ANODE) ; port DISP_RESET_1, sheet CNT4/CNT_RESET1, sheet CNT5/CNT_RESET1, sheet CNT5/CNT_RESET2

Not connected (* = marked no-connect by the designer): D?#2 2(2_ANODE); U?#1 1(5) 2(1) 3(0) 4(2) 5(6) 6(7) 7(3) 8(VSS) 9(8) 10(4) 11(9) 12(CARRY_OUT) 15(RESET); U?#2 1(5) 2(1)* 3(0)* 4(2)* 6(7)* 7(3)* 9(8)* 10(4)* 11(9)* 12(CARRY_OUT)*

### Notes on the sheet
- TYPE:NORMAL
- 60 SEC RESET
- TYPE:INVERTED
- (near U?#1) THT VERSION
- Seconds Counter
- MAIN
- B
- Artem Horiunov

### Library data of the parts
? = CMP-2100-03664-2: as R?#1 on sheet Counter_Normal; Depth: 0.8mm; Termination: SMD/SMT; Resistor Type: Thick Film; Series: RC; Construction: Rectangular; Features: Moisture Resistant; Packaging: Tape and Reel; Min Operating Temperature: -55°C; Number of Terminations: 2; Lead Pitch: 0.3mm; RoHS Compliant: Yes; Case/Package: 0603; Resistance Tolerance: 1%; Military Standard: Not; Weight: 7.1E-05oz; Number of Pins: 2; Tolerance: 1%; Length: 1.6mm; Case Code (Imperial): 0603; Lead Free: Lead Free; Width: 0.8mm; Max Power Dissipation: 100mW; Height: 0.45mm; Max Operating Temperature: 155°C; Case Code (Metric): 1608; Size Code: 0603
C?#1 = CMP-001-00018-6: as C1 on sheet ClockSystem; Pins: 2; Max Operating Temperature: 125°C; Min Operating Temperature: -55°C; Mounting Technology: SM; Case/Package: 0805; RoHS Compliant: True; Tolerance: 10%
CNT_RST_?#1-CNT_RST_?#5 = CMP-00001-5: Pad for testing
D?#1 D?#2 = CMP-12790-000084-1: as D1 on sheet ClockSystem; Max Operating Temperature: 150°C; Max Reverse Voltage (DC): 30V; Power Rating: 200mW; Termination: SMD/SMT; REACH SVHC: No SVHC; Voltage Rating (DC): 30V; Series: -; Current Rating: 200mA; RoHS Compliant: Yes; Max Power Dissipation: 200mW; Case/Package: SOT-23; Max Repetitive Reverse Voltage (Vrrm): 30V; Width: 1.3mm; Min Operating Temperature: -65°C; Lead Free: Lead Free; Forward Current: 200mA; Number of Pins: 3; Contact Plating: Tin; Package Quantity: 3000; Length: 2.9mm; Radiation Hardening: No; Max Forward Surge Current (Ifsm): 600mA; Height: 1mm; Packaging: Tape and Reel; Mount: Surface Mount; Weight: 0.000282oz
U?#1 = CMP-1623-00681-3: IC 10-OUT DECADE COUNTER 16TSSOP; Reset: Asynchronous; Number of Bits: 10; Turn-On Delay Time: 650ns; Clock Edge Trigger Type: Positive Edge; Min Supply Voltage: 3V; Frequency: 11MHz; Number of Elements: 1; Direction: Up; Max Supply Voltage: 18V; Sync/Async: Synchronous; Quiescent Current: 100uA; Packaging: Tape and Reel; Max Operating Temperature: 125°C; RoHS Compliant: Yes; Min Operating Temperature: -55°C; Contact Plating: Gold; Weight: 0.002183oz; Mount: Surface Mount; Technology: CMOS; Lead Free: Lead Free; Package Quantity: 2000; Propagation Delay: 650ns; Case/Package: TSSOP; Series: 4000B; Logic Function: Counter; Number of Bits per Element: 10; Number of Pins: 16
U?#2 = CMP-1623-00072-2: CMOS Decade Counter with 10 Decoded Outputs, D0016A, LARGE T&R; Manufacturer: Texas Instruments; Technology Family: CD4000; Schmitt Trigger: No; VCC(Max)(V): 18; Inputs: 1; tpd @ Nom Voltage(Max)(ns): 270; Rating: Military; Bits(#): 10; Output Drive (IOL/IOH)(Max)(mA): 1.5/-1.5; ICC @ Nom Voltage(Max)(mA): 0.03; F @ Nom Voltage(Max)(Mhz): 8; VCC(Min)(V): 3; Output Type: CMOS; Operating Temperature Range(C): -55 to 125; Generic Part Number: CD4017B; Type: Decade; DatasheetVersion: SCHS027C; Input Type: CMOS; Function: Counter; PackageReference: D0016A; Code_JEDEC: MS-012 variation AC; Voltage(Nom)(V): 10

## Sheet CounterMIN.SchDoc
size A4; SheetNumber: 12; SheetTotal: 12
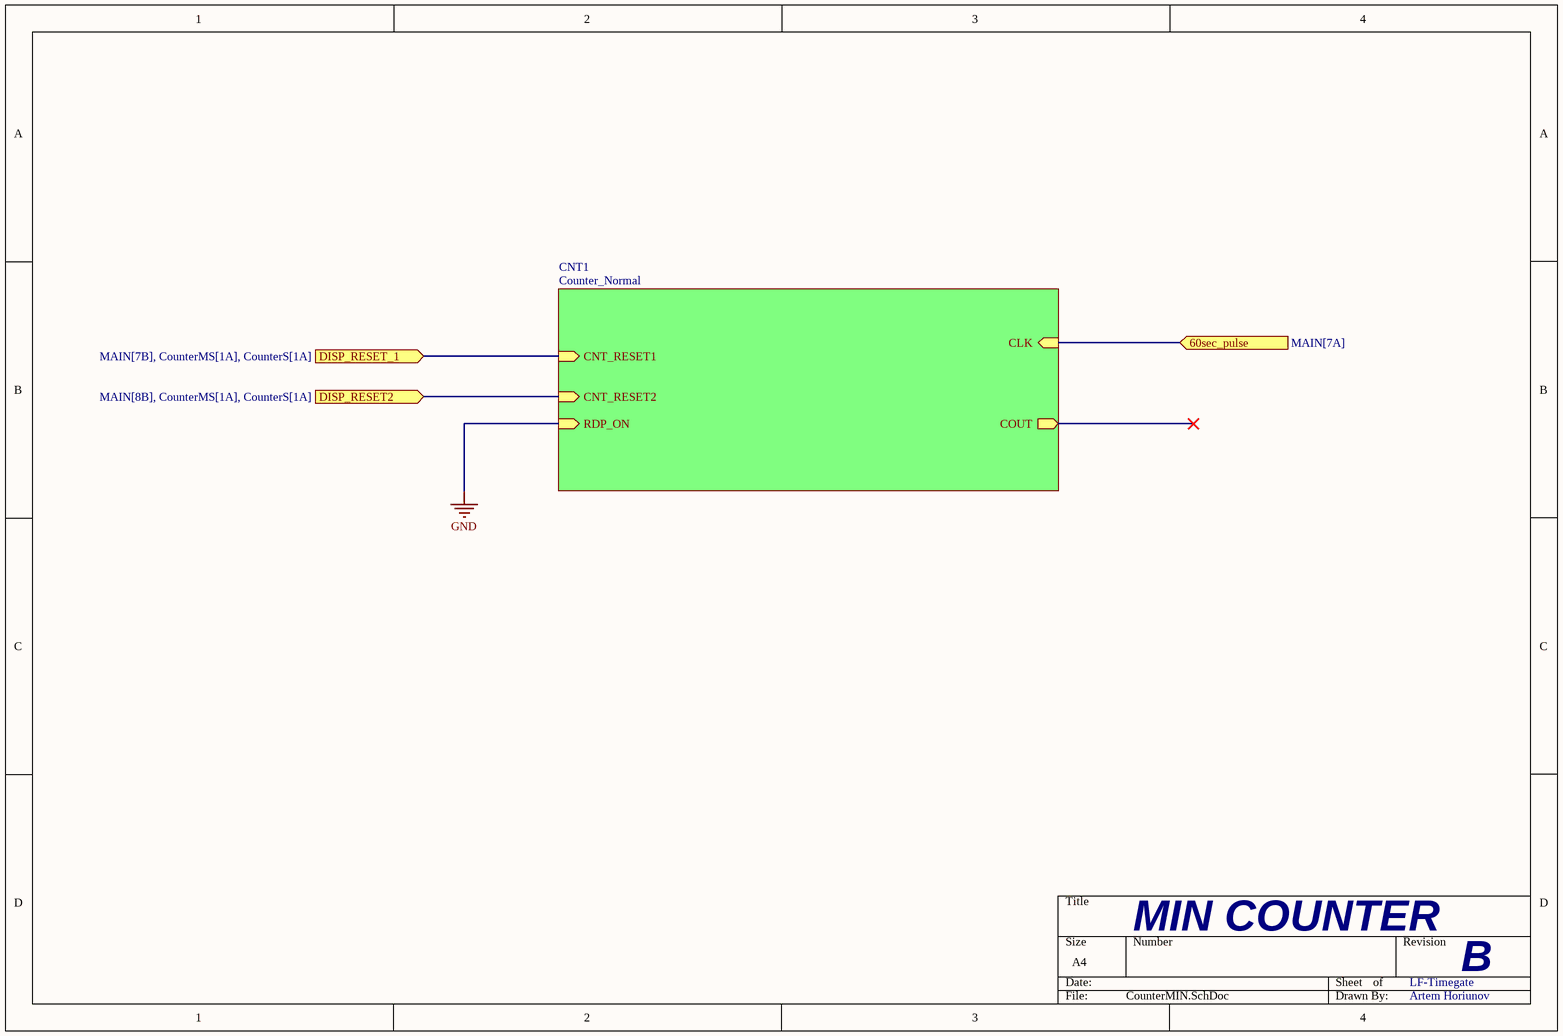
[diagram p7: CounterMIN.SchDoc]

### Sub-sheets
CNT1 = Counter_Normal: COUT (out), CNT_RESET1 (in), CNT_RESET2 (in), CLK (in), RDP_ON (in)

### Ports
60sec_pulse (in, see MAIN[7A]), DISP_RESET2 (in, see MAIN[8B], CounterMS[1A], CounterS[1A]), DISP_RESET_1 (in, see MAIN[7B], CounterMS[1A], CounterS[1A])

### Nets
1Min: port 60sec_pulse, sheet CNT1/CLK
ATUORESET: port DISP_RESET2, sheet CNT1/CNT_RESET2
CNT_RESET1: port DISP_RESET_1, sheet CNT1/CNT_RESET1

### Notes on the sheet
- MIN COUNTER
- LF-Timegate
- B
- Artem Horiunov

## Sheet StateMachine.SchDoc
size A4; SheetNumber: 8; SheetTotal: 12
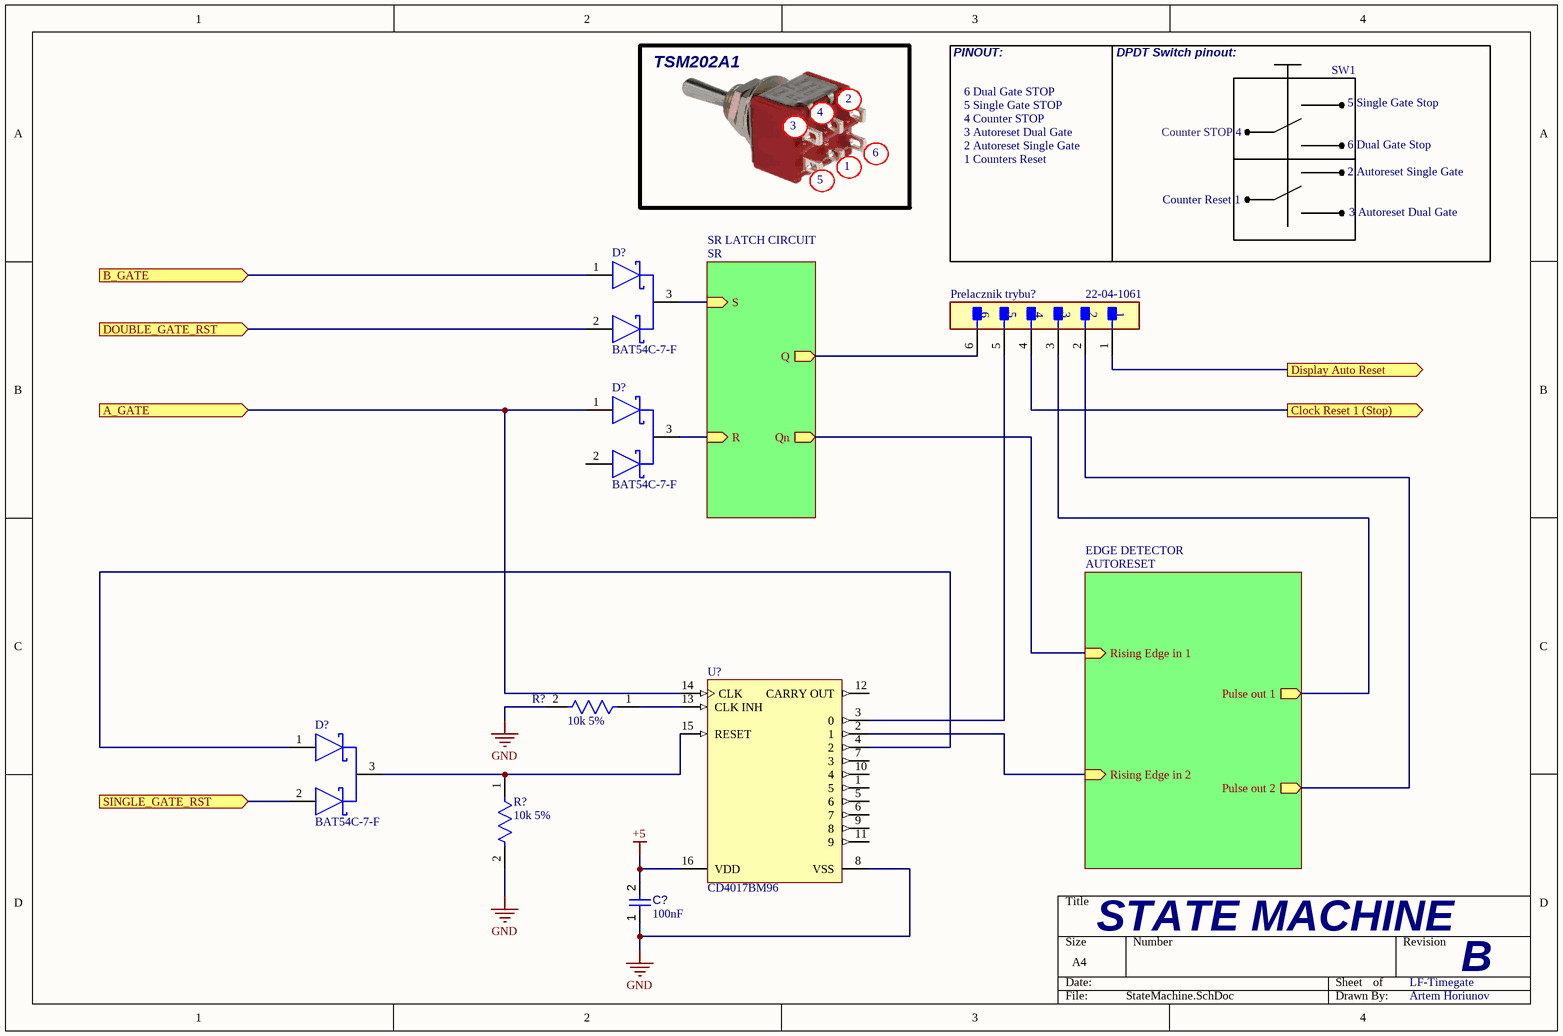
[diagram p8: StateMachine.SchDoc]

### Parts
(Parts that share a designator on the sheet are numbered #1, #2 ... from top to bottom, then left to right.)
C?#2  value 100nF  [CAPC2013X95X50LL10T25]  (hidden comment: Capacitor 100 nF +/-10% 50 V 0805)
D?#3  BAT54C-7-F  [FP-SOT23-IPC_B]
D?#4  BAT54C-7-F  [FP-SOT23-IPC_B]
D?#5  BAT54C-7-F  [FP-SOT23-IPC_B]
Prelacznik_trybu?  22-04-1061  [FP-22-04-1061-MFG]
R?#1  10k 5%  [FP-RC0603-0_55-IPC_C]
R?#2  10k 5%  [FP-RC0603-0_55-IPC_C]
U?#3  CD4017BM96  [D0016A_L]

### Sub-sheets
EDGE DETECTOR = AUTORESET: Rising Edge in 1 (in), Rising Edge in 2 (in), Pulse out 1 (out), Pulse out 2 (out)
SR LATCH CIRCUIT = SR: S (in), R (in), Q (out), Qn (out)

### Ports
A_GATE (in), B_GATE (in), Clock Reset 1 (Stop) (out), Display Auto Reset (out), DOUBLE_GATE_RST (in), SINGLE_GATE_RST (in)

### Nets
+5: C?#2.2 U?#3.16(VDD)
GND: C?#2.1 R?#1.2 R?#2.2 U?#3.8(VSS)  [project net R-SEG]
ATUORESET: Prelacznik_trybu?.1 ; port Display Auto Reset
CNT_RESET1: D?#3.2(2_ANODE) D?#5.2(2_ANODE) ; port DOUBLE_GATE_RST, port SINGLE_GATE_RST
Q: Prelacznik_trybu?.6 ; sheet SR LATCH CIRCUIT/Q
Qn: sheet SR LATCH CIRCUIT/Qn, sheet EDGE DETECTOR/Rising Edge in 1
R: D?#4.3(COMMON_CATHODE) ; sheet SR LATCH CIRCUIT/R
STOP_TIMER: Prelacznik_trybu?.4 ; port Clock Reset 1 (Stop)
NetA_GATE_1: D?#4.1(1_ANODE) U?#3.14(CLK) ; port A_GATE
NetB_GATE_1: D?#3.1(1_ANODE) ; port B_GATE
NetC?#6_1: U?#3.2(1) ; sheet EDGE DETECTOR/Rising Edge in 2
NetD?#3_3: D?#3.3(COMMON_CATHODE) ; sheet SR LATCH CIRCUIT/S
NetD?#5_1: D?#5.1(1_ANODE) U?#3.4(2)
NetD?#5_3: D?#5.3(COMMON_CATHODE) R?#2.1 U?#3.15(RESET)
NetPrelacznik_trybu?_2: Prelacznik_trybu?.2 ; sheet EDGE DETECTOR/Pulse out 2
NetPrelacznik_trybu?_3: Prelacznik_trybu?.3 ; sheet EDGE DETECTOR/Pulse out 1
NetPrelacznik_trybu?_5: Prelacznik_trybu?.5 U?#3.3(0)
NetR?#1_1: R?#1.1 U?#3.13(CLK_INH)

Not connected (* = marked no-connect by the designer): D?#4 2(2_ANODE); U?#3 1(5) 5(6) 6(7) 7(3) 9(8) 10(4) 11(9) 12(CARRY_OUT)

### Notes on the sheet
- TSM202A1
- 4
- 2
- PINOUT:
- 6 Dual Gate STOP
- 5 Single Gate STOP
- DPDT Switch pinout:
- SW1
- 5 Single Gate Stop
- 3
- 1
- 6
- 4 Counter STOP
- 3 Autoreset Dual Gate
- 2 Autoreset Single Gate
- 1 Counters Reset
- Counter STOP 4
- 6 Dual Gate Stop
- 5
- Counter Reset 1
- STATE MACHINE
- LF-Timegate
- B
- Artem Horiunov

### Library data of the parts
C?#2 = CMP-001-00018-6: as C1 on sheet ClockSystem; Pins: 2; Max Operating Temperature: 125°C; Min Operating Temperature: -55°C; Mounting Technology: SM; Case/Package: 0805; RoHS Compliant: True; Tolerance: 10%
D?#3-D?#5 = CMP-12790-000084-1: as D1 on sheet ClockSystem; Max Operating Temperature: 150°C; Max Reverse Voltage (DC): 30V; Power Rating: 200mW; Termination: SMD/SMT; REACH SVHC: No SVHC; Voltage Rating (DC): 30V; Series: -; Current Rating: 200mA; RoHS Compliant: Yes; Max Power Dissipation: 200mW; Case/Package: SOT-23; Max Repetitive Reverse Voltage (Vrrm): 30V; Width: 1.3mm; Min Operating Temperature: -65°C; Lead Free: Lead Free; Forward Current: 200mA; Number of Pins: 3; Contact Plating: Tin; Package Quantity: 3000; Length: 2.9mm; Radiation Hardening: No; Max Forward Surge Current (Ifsm): 600mA; Height: 1mm; Packaging: Tape and Reel; Mount: Surface Mount; Weight: 0.000282oz
Prelacznik_trybu? = CMP-04776-000934-1: CONN HEADER VERT 6POS 2.5MM; Number of Positions: 6; Contact Resistance: 20mR; Insulation Resistance: 1GR; Glow Wire Compliant: Non-compliant; Current Rating: 3A; Max Voltage Rating (DC): 250.25kV; Voltage Rating (AC): 250V; Connector Type: Male Pin; Gender: Male; Hole Diameter: 1.19mm; Termination: Solder; Number of Circuits: 6; Number of Rows: 1; Mount: Through Hole; Lead Free: Lead Free; Contact Type: Male Pin; Lead Pitch: 2.5mm; Radiation Hardening: No; Packaging: Bulk; Pitch: 2.5mm; Contact Plating: Tin; Housing Color: Natural; Fastening Type: Friction; Contact Gender: Male; Length: 14.5mm; Orientation: Straight; Series: KK® 5045; Number of Contacts: 6; Halogen Free: Low Halogen; Min Operating Temperature: -40°C; Number of Poles: 6; Width: 5.8mm; Housing Material: Nylon; Max Operating Temperature: 105°C; Contact Material: Brass; Flammability Rating: UL94 V-0; Color: Natural; Contact Mating Length: 0.295inch; Working Voltage: 250V; Voltage Rating: 250V; Package Quantity: 1; Height: 11.7mm; Voltage Rating (DC): 250V
R?#1 R?#2 = CMP-2100-03664-2: as R?#1 on sheet Counter_Normal; Depth: 0.8mm; Termination: SMD/SMT; Resistor Type: Thick Film; Series: RC; Construction: Rectangular; Features: Moisture Resistant; Packaging: Tape and Reel; Min Operating Temperature: -55°C; Number of Terminations: 2; Lead Pitch: 0.3mm; RoHS Compliant: Yes; Case/Package: 0603; Resistance Tolerance: 1%; Military Standard: Not; Weight: 7.1E-05oz; Number of Pins: 2; Tolerance: 1%; Length: 1.6mm; Case Code (Imperial): 0603; Lead Free: Lead Free; Width: 0.8mm; Max Power Dissipation: 100mW; Height: 0.45mm; Max Operating Temperature: 155°C; Case Code (Metric): 1608; Size Code: 0603
U?#3 = CMP-1623-00072-2: as U?#2 on sheet CounterS; Output Type: CMOS; Operating Temperature Range(C): -55 to 125; Generic Part Number: CD4017B; Type: Decade; DatasheetVersion: SCHS027C; Input Type: CMOS; Function: Counter; PackageReference: D0016A; Code_JEDEC: MS-012 variation AC; Voltage(Nom)(V): 10

## Sheet SR.SchDoc
size A4; SheetNumber: 9; SheetTotal: 12
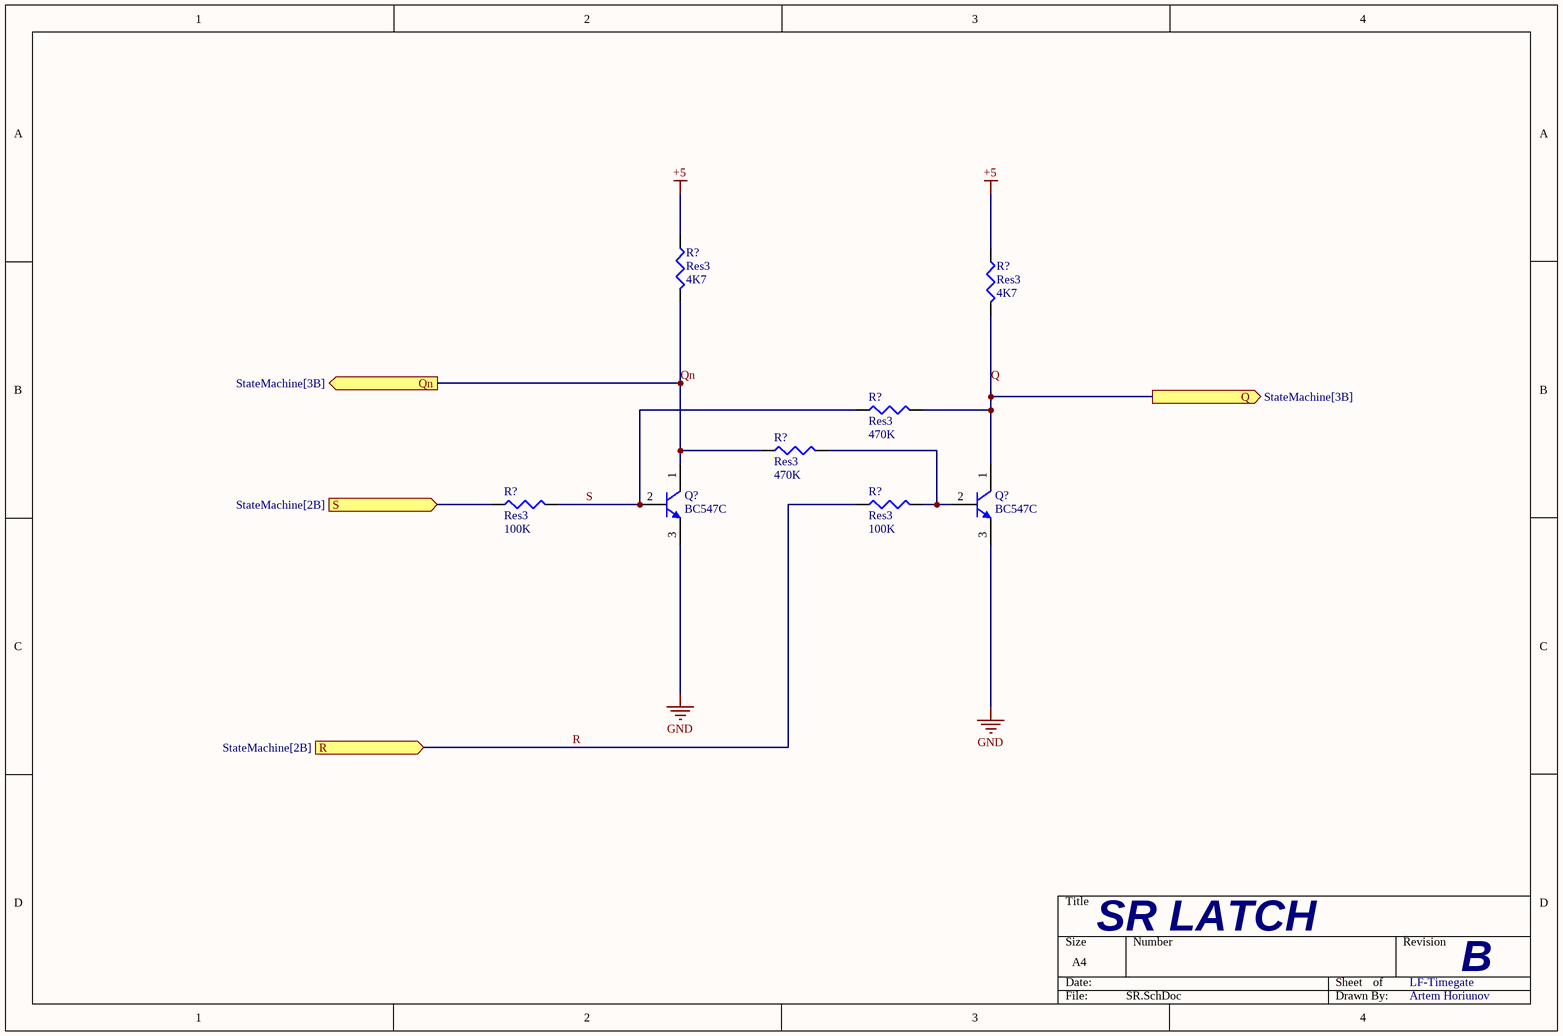
[diagram p9: SR.SchDoc]

### Parts
(Parts that share a designator on the sheet are numbered #1, #2 ... from top to bottom, then left to right.)
Q?#1  BC547C  [ONSC-TO-92-3-29-11]
Q?#2  BC547C  [ONSC-TO-92-3-29-11]
R?#3  Res3  value 4K7  [J1-0603]
R?#4  Res3  value 4K7  [J1-0603]
R?#5  Res3  value 470K  [J1-0603]
R?#6  Res3  value 470K  [J1-0603]
R?#7  Res3  value 100K  [J1-0603]
R?#8  Res3  value 100K  [J1-0603]

### Ports
Q (out, see StateMachine[3B]), Qn (out, see StateMachine[3B]), R (in, see StateMachine[2B]), S (in, see StateMachine[2B])

### Nets
+5: R?#3.1 R?#4.1
GND: Q?#1.3(E) Q?#2.3(E)  [project net R-SEG]
Q: Q?#2.1(C) R?#4.2 R?#5.2 ; port Q
Qn: Q?#1.1(C) R?#3.2 R?#6.1 ; port Qn
R: R?#8.1 ; port R
S: Q?#1.2(B) R?#5.1 R?#7.2
NetD?#3_3: R?#7.1 ; port S
NetQ?#2_2: Q?#2.2(B) R?#6.2 R?#8.2

### Notes on the sheet
- SR LATCH
- LF-Timegate
- B
- Artem Horiunov

### Library data of the parts
Q?#1 Q?#2 = CMP-1048-01437-1: Amplifier Transistor, NPN Silicon, 3-Pin TO-92, Bulk Box; Manufacturer: On Semiconductor; IC Continuous (A): 0.1; fT Min (MHz): 150; Mounting Technology: Through Hole; ComponentLink1URL: http://www.onsemi.com/; ComponentLink1Description: Manufacturer URL; ComponentLink3URL: http://www.onsemi.cn/pub_link/Collateral/2N6426-D.PDF; DatasheetVersion: Rev. 7; PackageVersion: Rev. AM; Packing: Bulk Box; RoHS: FALSE; Polarity: NPN; PartNumber: BC547C; ComponentLink2URL: http://www.onsemi.com/pub_link/Collateral/BC546-D.PDF; ComponentLink3Description: Package Specification; PackageDescription: 3-Pin Transistor Outline, Body 4.825 x 3.685 mm, Pitch 1.27 mm; PackageReference: TO-92-3-29-11_AM_SL; ComponentLink2Description: Datasheet
R?#3-R?#8 = Res3: Resistor; Published: 8-Jun-2000; LatestRevisionDate: 29-May-2009; LatestRevisionNote: IPC-7351 Footprint Added.; PackageReference: J1-0603; Publisher: Altium Limited; PackageDescription: Chip Resistor